# Altium project PCB.PrjPcb (part 8 of 8)

## Sheet USB.SchDoc
size 558 x 431 mm; SheetNumber: 16; SheetTotal: 25; Sheet_Name: USB; Size: 11x17
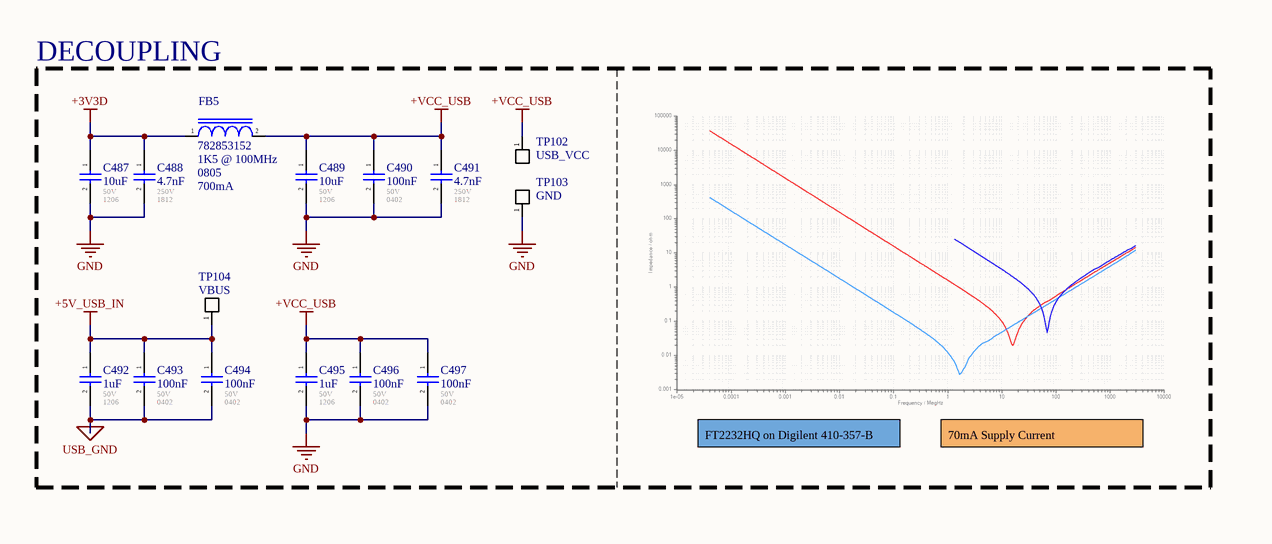
[diagram p51: USB.SchDoc, top left]
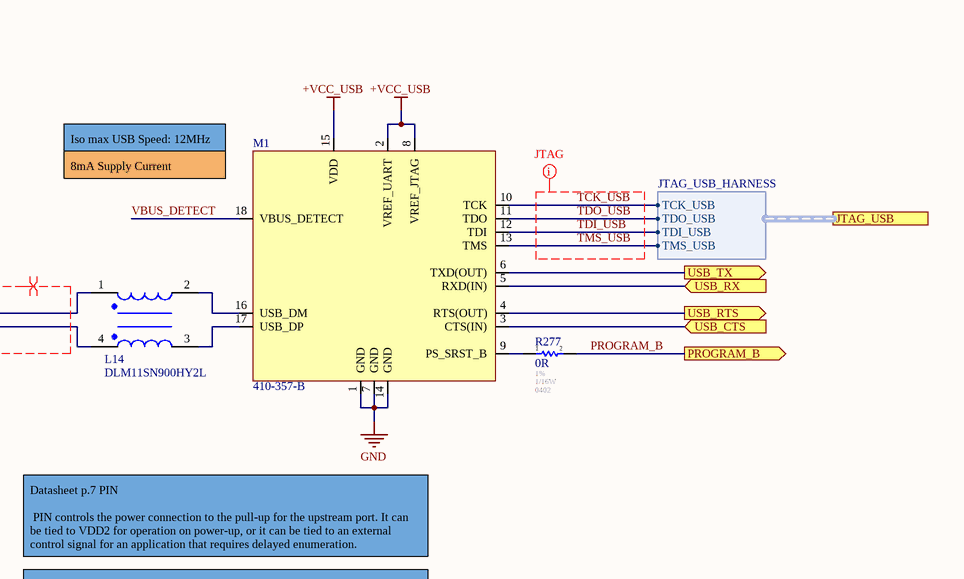
[diagram p52: USB.SchDoc, top right]
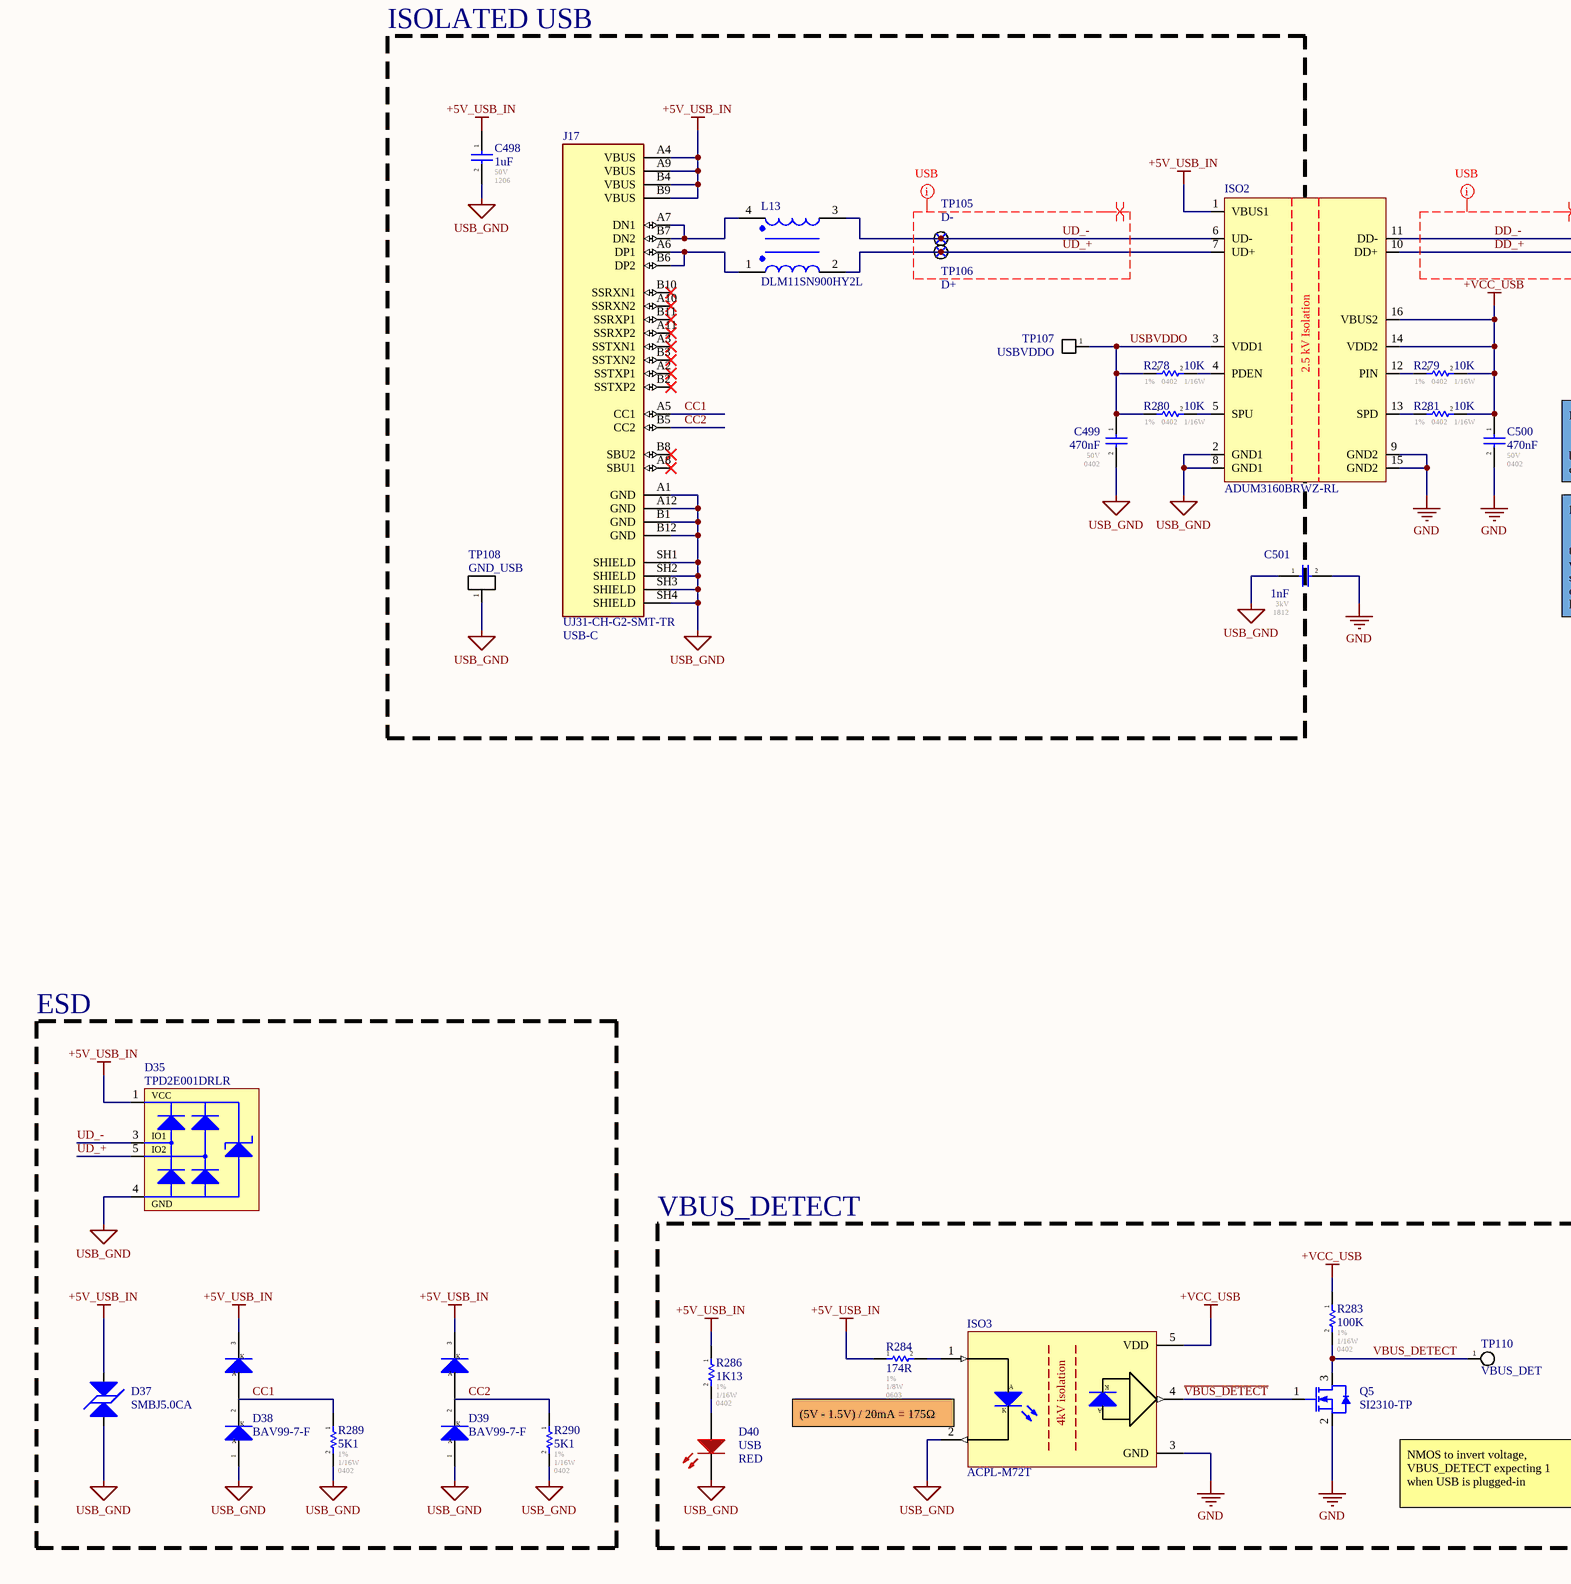
[diagram p53: USB.SchDoc, bottom left]
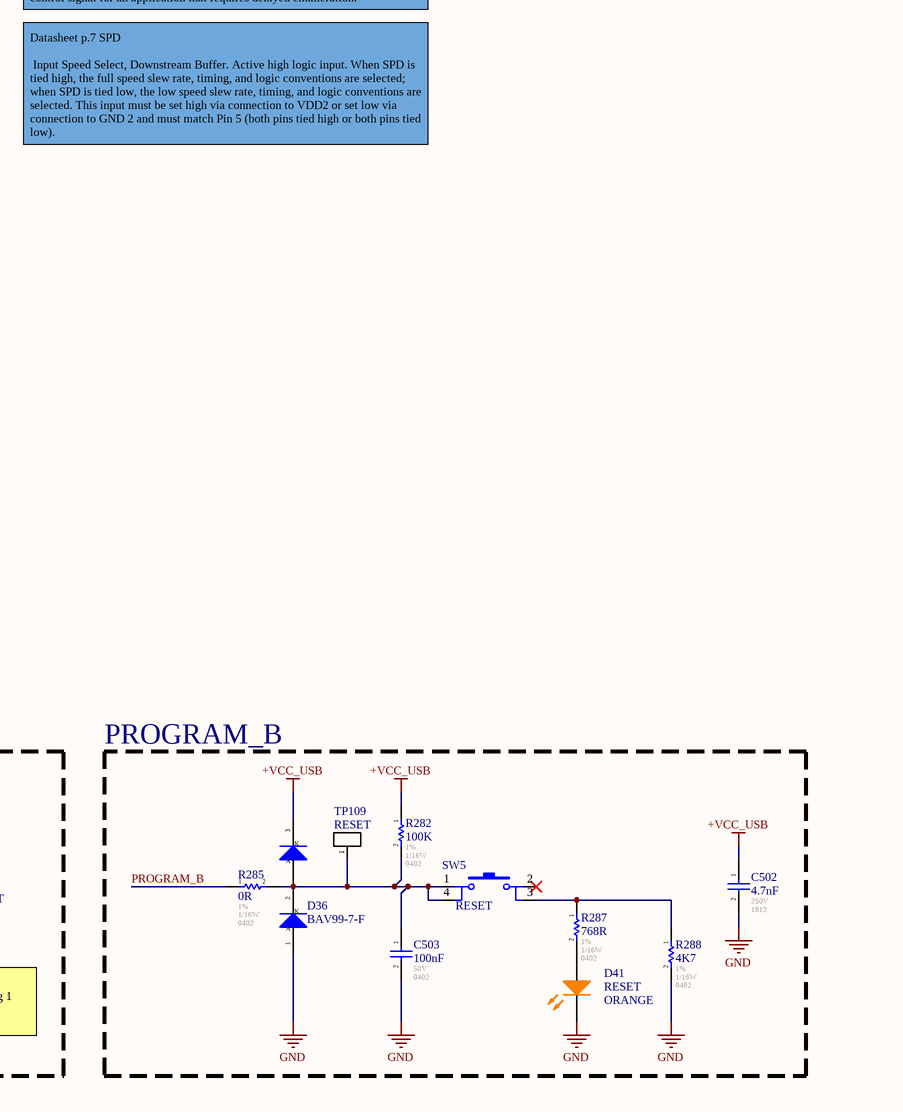
[diagram p54: USB.SchDoc, bottom right]

### Parts
C487  10uF  Voltage - Rated: 50V  Footprint: 1206  [CAP_1206]
C488  4.7nF  Voltage - Rated: 250V  Footprint: 1812  [CAP_1812]
C489  10uF  Voltage - Rated: 50V  Footprint: 1206  [CAP_1206]
C490  100nF  Voltage - Rated: 50V  Footprint: 0402  [CAP_0402]
C491  4.7nF  Voltage - Rated: 250V  Footprint: 1812  [CAP_1812]
C492  1uF  Voltage - Rated: 50V  Footprint: 1206  [CAP_1206]
C493  100nF  Voltage - Rated: 50V  Footprint: 0402  [CAP_0402]
C494  100nF  Voltage - Rated: 50V  Footprint: 0402  [CAP_0402]
C495  1uF  Voltage - Rated: 50V  Footprint: 1206  [CAP_1206]
C496  100nF  Voltage - Rated: 50V  Footprint: 0402  [CAP_0402]
C497  100nF  Voltage - Rated: 50V  Footprint: 0402  [CAP_0402]
C498  1uF  Voltage - Rated: 50V  Footprint: 1206  [CAP_1206]
C499  470nF  Voltage - Rated: 50V  Footprint: 0402  [CAP_0402]
C500  470nF  Voltage - Rated: 50V  Footprint: 0402  [CAP_0402]
C501  1nF  Voltage - Rated: 3kV  Footprint: 1812  [CAP_1812]
C502  4.7nF  Voltage - Rated: 250V  Footprint: 1812  [CAP_1812]
C503  100nF  Voltage - Rated: 50V  Footprint: 0402  [CAP_0402]
D35  TPD2E001DRLR  [TVS_USB_TPD2E001DRLR]
D36  BAV99-7-F  [SOT23-3]
D37  SMBJ5.0CA  [TVS_PWR_SMBJ5.0CA]
D38  BAV99-7-F  [SOT23-3]
D39  BAV99-7-F  [SOT23-3]
D40  USB  value RED  [LED_0603]
D41  RESET  value ORANGE  [LED_0603]
FB5  782853152  Impedance @ Freq: 1K5 @ 100MHz  Package / Case: 0805  Current Rating: 700mA  [IND_0805]
ISO2  ADUM3160BRWZ-RL  [ISO_ADUM3160BRWZ-RL]
ISO3  ACPL-M72T  [SOIC-5_4.4MM]
J17  UJ31-CH-G2-SMT-TR  Connector Type: USB-C  [UJ31-CH-G2-SMT-TR]
L13  DLM11SN900HY2L  [DLM11SN900HY2L]
L14  DLM11SN900HY2L  [DLM11SN900HY2L]
M1  410-357-B  [MOD_JTAG_410-357-B]
Q5  SI2310-TP  [TRX_NMOS_SI2310-TP]
R277  0R  Tolerance: 1%  Power: 1/16W  Package / Case: 0402  [RES_0402]
R278  10K  Tolerance: 1%  Power: 1/16W  Package / Case: 0402  [RES_0402]
R279  10K  Tolerance: 1%  Power: 1/16W  Package / Case: 0402  [RES_0402]
R280  10K  Tolerance: 1%  Power: 1/16W  Package / Case: 0402  [RES_0402]
R281  10K  Tolerance: 1%  Power: 1/16W  Package / Case: 0402  [RES_0402]
R282  100K  Tolerance: 1%  Power: 1/16W  Package / Case: 0402  [RES_0402]
R283  100K  Tolerance: 1%  Power: 1/16W  Package / Case: 0402  [RES_0402]
R284  174R  Tolerance: 1%  Power: 1/8W  Package / Case: 0603  [RES_0603]
R285  0R  Tolerance: 1%  Power: 1/16W  Package / Case: 0402  [RES_0402]
R286  1K13  Tolerance: 1%  Power: 1/16W  Package / Case: 0402  [RES_0402]
R287  768R  Tolerance: 1%  Power: 1/16W  Package / Case: 0402  [RES_0402]
R288  4K7  Tolerance: 1%  Power: 1/16W  Package / Case: 0402  [RES_0402]
R289  5K1  Tolerance: 1%  Power: 1/16W  Package / Case: 0402  [RES_0402]
R290  5K1  Tolerance: 1%  Power: 1/16W  Package / Case: 0402  [RES_0402]
SW5  RESET  [SWI_TACT_B3SN-3012P]
TP102  USB_VCC  [TP_PAD]  (no BOM)
TP103  GND  [TP_PAD]  (no BOM)
TP104  VBUS  [TP_PAD]  (no BOM)
TP105  D-  [TP_PAD_TINY]  (no BOM)
TP106  D+  [TP_PAD_TINY]  (no BOM)
TP107  USBVDDO  [TP_PAD]  (no BOM)
TP108  GND_USB  [TP_HOLE]  (no BOM)
TP109  RESET  [TP_HOLE]  (no BOM)
TP110  VBUS_DET  [TP_PAD_SMALL]  (no BOM)

### Blocks framed on the sheet
DECOUPLING: C487-C497 FB5 TP102-TP104
ISOLATED USB: C498 C499 J17 L13 R278 R280 TP105-TP108
ESD: D35 D37-D39 R289 R290
VBUS_DETECT: D40 ISO3 Q5 R283 R284 R286 TP110
PROGRAM_B: C502 C503 D36 D41 R282 R285 R287 R288 SW5 TP109

### Ports
JTAG_USB (harness JTAG_USB_HARNESS), PROGRAM_B (out), USB_CTS (in), USB_RTS (out), USB_RX (in), USB_TX (out)

### Harnesses
JTAG_USB_HARNESS: TCK_USB, TDO_USB, TDI_USB, TMS_USB

### Nets
+3V3D: C487.1 C488.1 FB5.1
+5V_USB_IN: C492.1 C493.1 C494.1 C498.1 D35.1(VCC) D37.1 D38.3(K) D39.3(K) ISO2.1(VBUS1) J17.A4(VBUS) J17.A9(VBUS) J17.B4(VBUS) J17.B9(VBUS) R284.1 R286.1 TP104.1(A)
+VCC_USB: C489.1 C490.1 C491.1 C495.1 C496.1 C497.1 C500.1 C502.1 D36.3(K) FB5.2 ISO2.14(VDD2) ISO2.16(VBUS2) ISO3.5(VDD) M1.2(VREF_UART) M1.8(VREF_JTAG) M1.15(VDD) R279.2 R281.2 R282.1 R283.1 TP102.1(A)
GND: C487.2 C488.2 C489.2 C490.2 C491.2 C495.2 C496.2 C497.2 C500.2 C501.2 C502.2 C503.2 D36.1(A) D41.2(K) ISO2.9(GND2) ISO2.15(GND2) ISO3.3(GND) M1.1(GND) M1.7(GND) M1.14(GND) Q5.2(S) R288.2 TP103.1(A)
USB_GND: C492.2 C493.2 C494.2 C498.2 C499.2 C501.1 D35.4(GND) D37.2 D38.1(A) D39.1(A) D40.2(K) ISO2.2(GND1) ISO2.8(GND1) ISO3.2(CATHODE) J17.A1(GND) J17.A12(GND) J17.B1(GND) J17.B12(GND) J17.SH1(SHIELD) J17.SH2(SHIELD) J17.SH3(SHIELD) J17.SH4(SHIELD) R289.2 R290.2 TP108.1(A)
~{VBUS_DETECT}: ISO3.4(VOUT) Q5.1(G)  [project net ~{VBUS_DETECT_16}]
CC1: D38.2(K) J17.A5(CC1) R289.1  [project net CC1_16]
CC2: D39.2(K) J17.B5(CC2) R290.1  [project net CC2_16]
DD_+: ISO2.10(DD+) L14.4  [project net DD_+_16]
DD_-: ISO2.11(DD-) L14.1  [project net DD_-_16]
PROGRAM_B: R277.2 R285.1 ; port PROGRAM_B
TCK_USB: M1.10(TCK) ; port JTAG_USB.TCK_USB
TDI_USB: M1.12(TDI) ; port JTAG_USB.TDI_USB
TDO_USB: M1.11(TDO) ; port JTAG_USB.TDO_USB
TMS_USB: M1.13(TMS) ; port JTAG_USB.TMS_USB
UD_+: D35.5(IO2) ISO2.7(UD+) L13.2 TP106.1(A)  [project net UD_+_16]
UD_-: D35.3(IO1) ISO2.6(UD-) L13.3 TP105.1(A)  [project net UD_-_16]
USB_CTS: M1.3(CTS(IN)) ; port USB_CTS
USB_RTS: M1.4(RTS(OUT)) ; port USB_RTS
USB_RX: M1.5(RXD(IN)) ; port USB_RX
USB_TX: M1.6(TXD(OUT)) ; port USB_TX
USBVDDO: C499.1 ISO2.3(VDD1) R278.1 R280.1 TP107.1(A)  [project net USBVDDO_16]
VBUS_DETECT: M1.18(VBUS_DETECT) Q5.3(D) R283.2 TP110.1(A)  [project net VBUS_DETECT_16]
NetC503_1: C503.1 D36.2(K) R282.2 R285.2 SW5.1 SW5.4 TP109.1(A)
NetD40_1: D40.1(A) R286.2
NetD41_1: D41.1(A) R287.2
NetISO2_4: ISO2.4(PDEN) R278.2
NetISO2_5: ISO2.5(SPU) R280.2
NetISO2_12: ISO2.12(PIN) R279.1
NetISO2_13: ISO2.13(SPD) R281.1
NetISO3_1: ISO3.1(ANODE) R284.2
NetJ17_A6: J17.A6(DP1) J17.B6(DP2) L13.1
NetJ17_A7: J17.A7(DN1) J17.B7(DN2) L13.4
NetL14_2: L14.2 M1.16(USB_DM)
NetL14_3: L14.3 M1.17(USB_DP)
NetM1_9: M1.9(PS_SRST_B) R277.1
NetR287_1: R287.1 R288.1 SW5.3

Not connected (* = marked no-connect by the designer): D35 2(NC); J17 A2(SSTXP1)* A3(SSTXN1)* A8(SBU1)* A10(SSRXN2)* A11(SSRXP2)* B2(SSTXP2)* B3(SSTXN2)* B8(SBU2)* B10(SSRXN1)* B11(SSRXP1)*; SW5 2*

### Layout directives
net class USB: DD_+, DD_-, UD_+, UD_-
differential pair: DD_+, DD_-, UD_+, UD_-
net class JTAG: TCK_USB, TDI_USB, TDO_USB, TMS_USB

### Notes on the sheet
- FT2232HQ on Digilent 410-357-B
- 70mA Supply Current
- (near M1) Iso max USB Speed: 12MHz
- (near M1) 8mA Supply Current
- Datasheet p.7 PIN
  PIN controls the power connection to the pull-up for the upstream port. It can be tied to VDD2 for operation on power-up, or it can be tied to an external control signal for an application that requires delayed enumeration.
- Datasheet p.7 SPD
  Input Speed Select, Downstream Buffer. Active high logic input. When SPD is tied high, the full speed slew rate, timing, and logic conventions are selected; when SPD is tied low, the low speed slew rate, timing, and logic conventions are selected. This input must be set high via connection to VDD2 or set low via connection to GND 2 and must match Pin 5 (both pins tied high or both pins tied low).
- (near ISO3) (5V - 1.5V) / 20mA = 175Ω
- NMOS to invert voltage, VBUS_DETECT expecting 1 when USB is plugged-in
- Sheet Name
- Project Title
- Global Project
- Revision
- Size
- Date
- Group
- Sheet
- of
- Filename
- Designers
- (in symbol ACPL-M72T) A; K; 4kV isolation
- (in symbol ISO_ADUM3160BRWZ-RL) 2.5 kV Isolation

### Library data of the parts
C487 C489 = CAP_CER: GRT31CR61H106KE01L / 1206 10uF 10% X5R Ceramic Capacitor; Mfr: Murata; Operating Temperature: -55C - 85C; Temperature Coefficient: X5R; ComponentLink1Description: Digikey; ComponentLink2Description: Datasheet; Tolerance: 10%; Ratings: AEC-Q200; Part#: GRT31CR61H106KE01L
  C487: ComponentLink1URL: https://www.digikey.ca/en/products/detail/murata-electronics/GRT31CR61H106KE01L/5416878; ComponentLink2URL: https://search.murata.co.jp/Ceramy/image/img/A01X/G101/ENG/GRT31CR61H106KE01-01.pdf; ComponentLink3Description: Octopart; ComponentLink3URL: https://octopart.com/grt31cr61h106ke01l-murata-62921736; ComponentLink4Description: Murata; ComponentLink4URL: https://www.murata.com/en-us/products/productdetail?partno=GRT31CR61H106KE01%23
  C489: ComponentLink1URL: [Digikey Link]; ComponentLink2URL: [Datasheet Link]
C488 C491 C502 = CAP_CER: GA343DR7GD472KW01L / 0402 4.7nF 10% X7R 1812 250VAC Ceramic Capacitor; Mfr: Murata; Ratings: Y3 - Safety; Operating Temperature: -55C - 125C; Temperature Coefficient: X7R; ComponentLink1Description: Digikey; ComponentLink1URL: https://www.digikey.ca/en/products/detail/murata-electronics/GA343DR7GD472KW01L/789292; ComponentLink2Description: Datasheet; ComponentLink2URL: https://search.murata.co.jp/Ceramy/image/img/A01X/G101/ENG/GA343DR7GD472KW01-01.pdf; ComponentLink3Description: Octopart; ComponentLink3URL: https://octopart.com/ga343dr7gd472kw01l-murata-197048?r=sp; Tolerance: 10%; Part#: GA343DR7GD472KW01L
  C502: ComponentLink4Description: Murata; ComponentLink4URL: https://www.murata.com/en-us/products/productdetail?partno=GA343DR7GD472KW01%23
C490 C493 C494 C496 C497 C503 = CAP_CER: GCM155R71H104KE02J / 0402 100nF 10% X7R Ceramic Capacitor; Mfr: Murata; Operating Temperature: -55C - 125C; Temperature Coefficient: X7R; ComponentLink1Description: Digikey; ComponentLink1URL: [Digikey Link]; Part#: GCM155R71H104KE02J; ComponentLink2Description: Datasheet; ComponentLink2URL: [Datasheet Link]; Tolerance: 10%; Ratings: AEC-Q200
C492 C495 C498 = CAP_CER: GCJ31CR71H105KA12L / 1206 1uF 10% X7R Ceramic Capacitor; Mfr: Murata; Operating Temperature: -55C - 125C; Temperature Coefficient: X7R; ComponentLink1Description: Digikey; Part#: GCJ31CR71H105KA12L; ComponentLink2Description: Datasheet; Tolerance: 10%; Ratings: AEC-Q200
  C492: ComponentLink1URL: https://www.digikey.ca/en/products/detail/murata-electronics/GCJ31CR71H105KA12L/10690321; ComponentLink2URL: https://search.murata.co.jp/Ceramy/image/img/A01X/G101/ENG/GCJ31CR71H105KA12-02B.pdf; ComponentLink3Description: Octopart; ComponentLink3URL: https://octopart.com/gcj31cr71h105ka12l-murata-57352446?r=sp; ComponentLink4Description: Murata; ComponentLink4URL: https://www.murata.com/en-us/products/productdetail?partno=GCJ31CR71H105KA12%23
  C495 C498: ComponentLink1URL: [Digikey Link]; ComponentLink2URL: [Datasheet Link]
C499 C500 = CAP_CER: CGA3E3X7R1H474K080AB / 0603 470nF 10% X7R Ceramic Capacitor; Mfr: TDK; Operating Temperature: -55C - 125C; Temperature Coefficient: X7R; ComponentLink1Description: Digikey; Part#: CGA3E3X7R1H474K080AB; ComponentLink2Description: Datasheet; Tolerance: 10%; Ratings: AEC-Q200
  C499: ComponentLink1URL: https://www.digikey.ca/en/products/detail/murata-electronics/GCM21BR71H474KA55L/1641662; ComponentLink2URL: https://search.murata.co.jp/Ceramy/image/img/A01X/G101/ENG/GCM21BR71H474KA55-01A.pdf; ComponentLink3Description: Octopart; ComponentLink3URL: https://octopart.com/gcm21br71h474ka55l-murata-7894857; ComponentLink4Description: Murata; ComponentLink4URL: https://www.murata.com/en-us/products/productdetail?partno=GCM21BR71H474KA55%23
  C500: ComponentLink1URL: [Digikey Link]; ComponentLink2URL: [Datasheet Link]
C501 = CAP_CER: C1812C102KHRACAUTO / 0402 470pF 10% X7R Ceramic Capacitor; Mfr: KEMET; Operating Temperature: -55C - 125C; Temperature Coefficient: X7R; ComponentLink1Description: Digikey; ComponentLink1URL: https://www.digikey.com/en/products/detail/kemet/C1812C102KHRACAUTO/8109956; Part#: C1812C102KHRACAUTO; ComponentLink2Description: Datasheet; ComponentLink2URL: https://connect.kemet.com:7667/gateway/IntelliData-ComponentDocumentation/1.0/download/datasheet/C1812C102KHRACAUTO; Tolerance: 10%; Ratings: AEC-Q200; ComponentLink3Description: KEMET; ComponentLink3URL: https://www.kemet.com/en/us/capacitors/ceramic/product/C1812C102KHRACAUTO.html; ComponentLink4Description: Octopart; ComponentLink4URL: https://octopart.com/c1812c102khracauto-kemet-67309371?r=sp; Features: Low ESL, High Voltage; Supplier 1: Mouser; Supplier Part Number 1: 80-C1812C102KHRAUTO
D35 = TVS_USB_TPD2E001DRLR: TVS - USB TVS DIODE 5.5V - SOT-553; Manufacturer #1: Texas Instruments; Value: 11V Breakdown; Voltage Rating: 5.5V (Max); GRAMS Lib Spec: 2.8; Magnetic Material: YES; Cryo: UNKNOWN; Tolerance: *; Current Rating: *; Power Max: *; HelpURL: http://www.ti.com/lit/ds/symlink/tpd2e001.pdf; CreatedBy/Date: Jonathan Bouchard 2018-07-10; VerifiedBy: Arnaud Samson 16-07-18; Temperature: -40°C ~ 85°C (TA); Package: SOT-553; Manufacturer #2: *; Note: *; Assembly Type: SMD; Part Number #2: *; Part Number #1: TPD2E001DRLR; Polarized: YES; Supplier 1: Digi-Key; Supplier Part Number 1: 296-21883-1-ND
D36 D38 D39 = DIODE_TVS_DUAL: Diode Array 1 Pair Series Connection 75 V 300mA (DC) Surface Mount TO-236-3, SC-59, SOT-23-3; Mfr: Diodes Incorporated; Voltage - DC Reverse: 75V; Voltage - Forward: 1.25V @ 150mA; Reverse Recovery Time: 4ns; Capacitance: 2pF; Current - Reverse Leakage: 2.5µA @ 75V; Operating Temperature: -65C - 150C; Package / Case: SOT-23-3; Current: 300mA; ComponentLink1Description: Digikey; ComponentLink1URL: https://www.digikey.ca/en/products/detail/diodes-incorporated/BAV99-7-F/815018; ComponentLink2Description: Datasheet; ComponentLink2URL: https://www.diodes.com/assets/Datasheets/BAV99.pdf; ComponentLink3Description: Octopart; ComponentLink3URL: https://octopart.com/bav99-7-f-diodes+inc.-326328; Supplier 1: Future Electronics; Supplier Part Number 1: 3851920
D37 = TVS_PWR_SMBJ5.0CA: TVS - BIDIR 5V 9.2V 600W - DO214AA; Manufacturer #1: Littelfuse Inc.; Value: Vbr = 6.4V -  Clamp = 9.2V; Voltage Rating: 5V Standoff; Current Rating: 65.3 A (Ipp); Power Max: 600W (Pppm); GRAMS Lib Spec: 2.8; Magnetic Material: UNKNOWN; Polarized: NO; Tolerance: *; HelpURL: http://www.littelfuse.com/~/media/electronics/datasheets/tvs_diodes/littelfuse_tvs_diode_smbj_datasheet.pdf.pdf; CreatedBy/Date: Jonathan Bouchard - 2019-03-22; VerifiedBy: Nicolas V. (2019-05-06); Temperature: -65°C ~ 150°C (TJ); Package: DO214AA; Manufacturer #2: *; Note: *; Assembly Type: SMD; Part Number #2: *; Part Number #1: SMBJ5.0CA; Supplier 1: Digi-Key; Supplier Part Number 1: SMBJ5.0CALFCT-ND; Cryo: UNKNOWN
D40 = LED_SML-311UTT86: LED - 620nM RED 2mA - 0603; Voltage: 1.8V; Mfg: ROHM Semiconductor; Power: 44mW; Current: 2mA; HelpURL: http://media.digikey.com/pdf/Data%20Sheets/Rohm%20PDFs/SML-311%20Series.pdf; CreatedBy: Jonathan Bouchard; Temperature: -30°C to 85°C; Package: 0603; Precision: *; Mfg Part Number: SML-311UTT86; Supplier 1: Digikey; Supplier Part Number 1: 511-1304-1-ND
D41 = LED_SML-311DTT86: LED - 611nM ORANGE 2mA - 0603; Voltage: 1.8V; Mfg: ROHM Semiconductor; Power: 44mW; Current: 2mA; HelpURL: http://media.digikey.com/pdf/Data%20Sheets/Rohm%20PDFs/SML-311%20Series.pdf; CreatedBy: Jonathan Bouchard; Temperature: -40°C to 85°C; Package: 0603; Precision: *; Mfg Part Number: SML-311DTT86; Supplier 1: Digikey; Supplier Part Number 1: 511-1303-1-ND
FB5 = FERRITE_BEAD: 600 Ohms @ 100 MHz 1 Signal Line Ferrite Bead 0603 (1608 Metric) 1A 200mOhm; Manufacturer: Wurth Elektronik; Resistance: 350mR; Operating Temperature: -55C - 125C; Rating: AEC-Q200; ComponentLink1Description: Digikey; ComponentLink1URL: https://www.digikey.ca/en/products/detail/w%C3%BCrth-elektronik/782853152/5168812; ComponentLink3Description: Octopart; ComponentLink3URL: https://octopart.com/782853152-wurth+elektronik-56466774?r=sp; ComponentLink5Description: Datasheet; ComponentLink5URL: https://www.we-online.com/en/components/products/datasheet/782853152.pdf
ISO2 = ISO_ADUM3160BRWZ-RL: ISO - DGTL ISO 2.5KV 2CH USB - 16SOIC; Manufacturer #1: Analog Devices; Value: 2500Vrms voltage isolation; Voltage Rating: 3~5.5V; GRAMS Lib Spec: 2.8; Magnetic Material: UNKNOWN; Polarized: Yes; Tolerance: *; Current Rating: *; Power Max: *; HelpURL: https://www.analog.com/media/en/technical-documentation/data-sheets/ADuM3160.pdf; CreatedBy/Date: Tommy Rossignol 2018-11-16; VerifiedBy: Caroline Paulin - 13 février 2019; Temperature: -40°C ~ 105°C; Package: 16-SOIC; Manufacturer #2: *; Assembly Type: SMD; Part Number #2: *; Part Number #1: ADUM3160BRWZ-RL; Supplier 1: Digi-Key; Supplier Part Number 1: ADUM3160BRWZ-RLCT-ND; Cryo: UNKNOWN
ISO3 = ACPL-M72T: Logic Output Optoisolator Push-Pull, Totem Pole 4000Vrms 1 Channel 25kV/µs CMTI 5-SO; Mfr: Broadcom Limited; Number of channels: 1; Common Mode Transient: 25kV/us; Voltage - Forward: 1.5V; Current - Forward: 20mA; Voltage - Supply: 3V - 5.5V; Qualification: AEC-Q100; Voltage - Isolation: 4000Vrms; Output Topology: Push-Pull; Operating Temperature: -40C - 125C; Package: SOIC6 - 5 Leads; ComponentLink1Description: Digikey; ComponentLink1URL: https://www.digikey.ca/en/products/detail/broadcom-limited/ACPL-M72T-000E/2347227; ComponentLink2Description: Datasheet; ComponentLink2URL: https://docs.broadcom.com/doc/AV02-2180EN
J17 = CONN_UJ31-CH-G2-SMT-TR: Type C, USB 3.1 Gen 2, 5 A, Right Angle, Surface Mount _SMT_, USB Receptacle; Mfr: CUI Devices; Number of Contacts: 24; Specifications: USB 3.2 Gen 2 (USB 3.1 Gen 2, Superspeed + (USB 3.1)); Current Rating: 6.25A; Voltage Rating: 20V; Operating Temperature: -25C - 80C; Digikey Part Number: 102-4483-1-ND; ComponentLink1Description: Digikey; ComponentLink1URL: https://www.digikey.ca/en/products/detail/cui-devices/UJ31-CH-G2-SMT-TR/8024057; Supplier 1: Digi-Key; Supplier Part Number 1: 102-4483-1-ND
L13 L14 = IND_DLM11SN900HY2L: 2 Line Common Mode Choke Surface Mount 90 Ohms @ 100MHz 100mA DCR 1.38Ohm; Voltage Rating: 5V; Impedance: 90 Ohms @ 100MHz; Current Rating: 100mA; DC resistance: 1.38Ohm; Operating Temperature: -40C - 85C; Package: 0504; Supplier 1: Digi-Key; Supplier Part Number 1: 490-11941-1-ND
M1 = MOD_JTAG_410-357-B: MOD - JTAG-SMT3-NC Programming Module For Xilinx FPGA - 18-SMT; Manufacturer #1: Digilent; Voltage Rating: VDD: 2.97V~3.63V, VJTAG/VUART: 1.65V~5.5V; GRAMS Lib Spec: 2.8; Note: Prior to reflow, the JTAG-SMT3-NC module must be dried at 125°C for 17 hours; Magnetic Material: Unknown; Polarized: Yes; Value: *; Tolerance: *; Current Rating: *; Power Max: *; HelpURL: https://reference.digilentinc.com/_media/reference/programmers/jtag-smt3/jtag-smt3-nc_rm.pdf; CreatedBy/Date: Tommy Rossignol 2018-11-23; VerifiedBy: Nicolas V. (2019-01-28); Temperature: -40°C ~ 85°C; Package: 18-pad SMT; Manufacturer #2: *; Assembly Type: SMD; Part Number #2: *; Part Number #1: 410-357-B; Supplier 1: Digi-Key; Supplier Part Number 1: 1286-1196-ND; Cryo: UNKNOWN
Q5 = TRX_NMOS_SI2310-TP: TRX - MOSFET N-CH 60V 3A - SOT-23; Manufacturer #1: Micro Commercial Co; Power Max: 350mW; Voltage rating: 60V (Vds max), 2V (Vgs @ 250uA); Polarized: Yes; Magnetic Material: UNKNOWN; GRAMS Lib Spec: 2.8c; Current Rating: 3A; Manufacturer #2: *; Value: *; Part Number #1: SI2310-TP; Part Number #2: *; HelpURL: https://www.mccsemi.com/pdf/Products/SI2310(SOT-23)-A.pdf; Supplier 1: Digi-Key; Supplier Part Number 1: SI2310-TPMSCT-ND; Assembly Type: SMD; Temperature: -55°C ~ 150°C (TJ); Package: SOT-23; CreatedBy/Date: Louis-Daniel Gaulin / 20-02-2020; Tolerance: *; VerifiedBy: C.Paulin - 21/02/2020; Cryo: UNKNOWN
R277-R290 = RESISTOR: Automotive: AEC-Q200; Operating Temperature: *; # Digikey: *; ComponentLink1Description: Digikey; ComponentLink1URL: *; # Manufacturer: *
SW5 = SWI_TACT_B3SN-3012P: SWI - TACT SPST-NO 0.05A 24V - 4-SMD; Current: 50mA; Mfg: Omron; Mfg Part Number: B3SN-3012P; HelpURL: http://www.omron.com/ecb/products/pdf/en-b3sn.pdf; CreatedBy: Jonathan Bouchard; Temperature: -25°C ~ 70°C; Power: *; Precision: *; Package: 4-SMD; Value: *; Voltage: 24V; Supplier 1: Digikey; Supplier Part Number 1: SW261CT-ND
TP102-TP104 TP107 = TESTPOINT_PAD: Test Point
TP105 TP106 = TESTPOINT_PAD_TINY: Test Point
TP108 TP109 = TESTPOINT: Test Point; ClassName: Testpoint
TP110 = TESTPOINT_PAD_SMALL: Test Point

## Sheet ETHERNET.SchDoc
size 558 x 431 mm; SheetNumber: 17; SheetTotal: 25; Sheet_Name: Ethernet; Size: 11x17
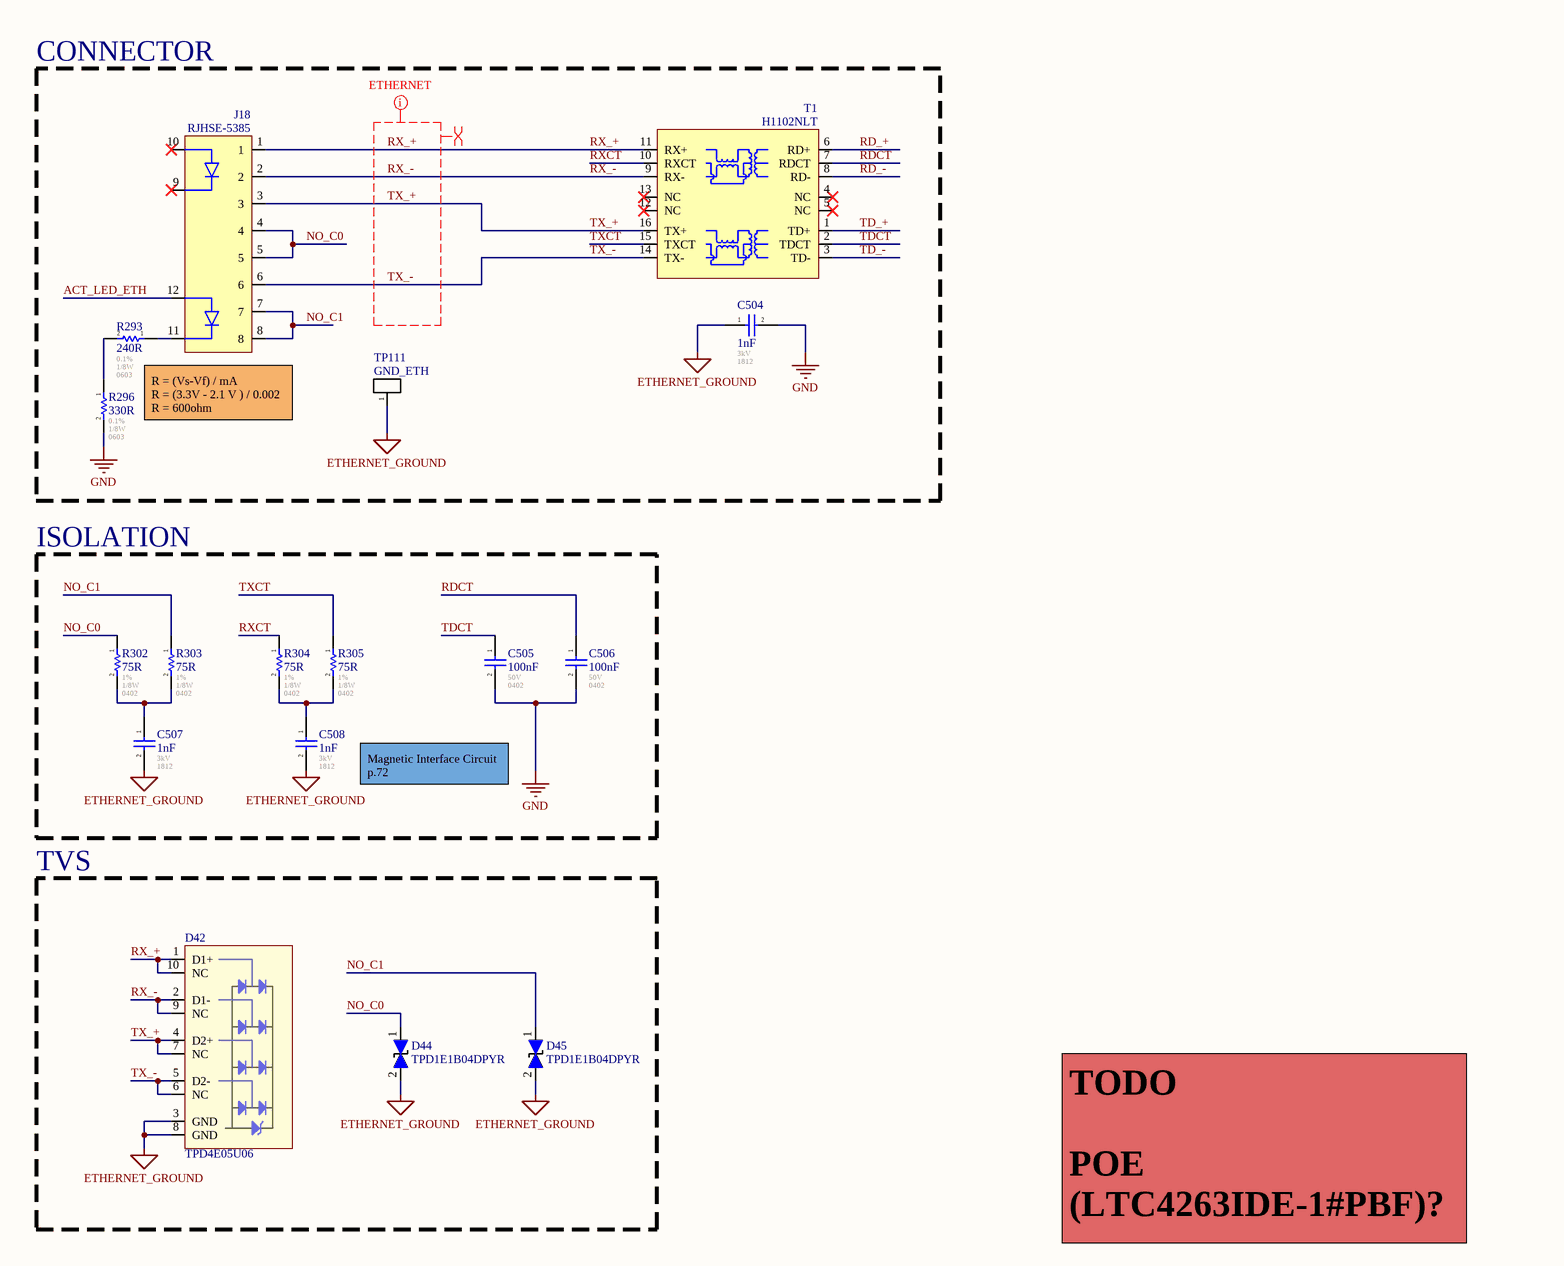
[diagram p55: ETHERNET.SchDoc, top left]
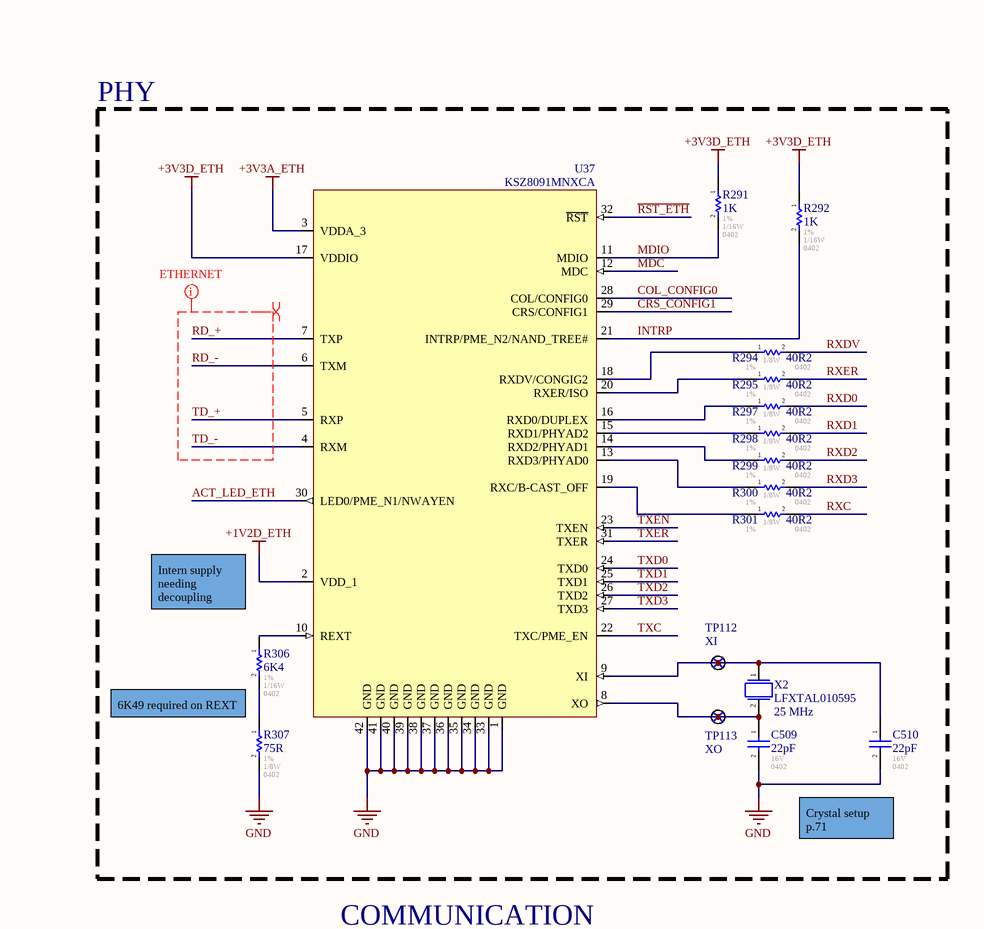
[diagram p56: ETHERNET.SchDoc, top right]
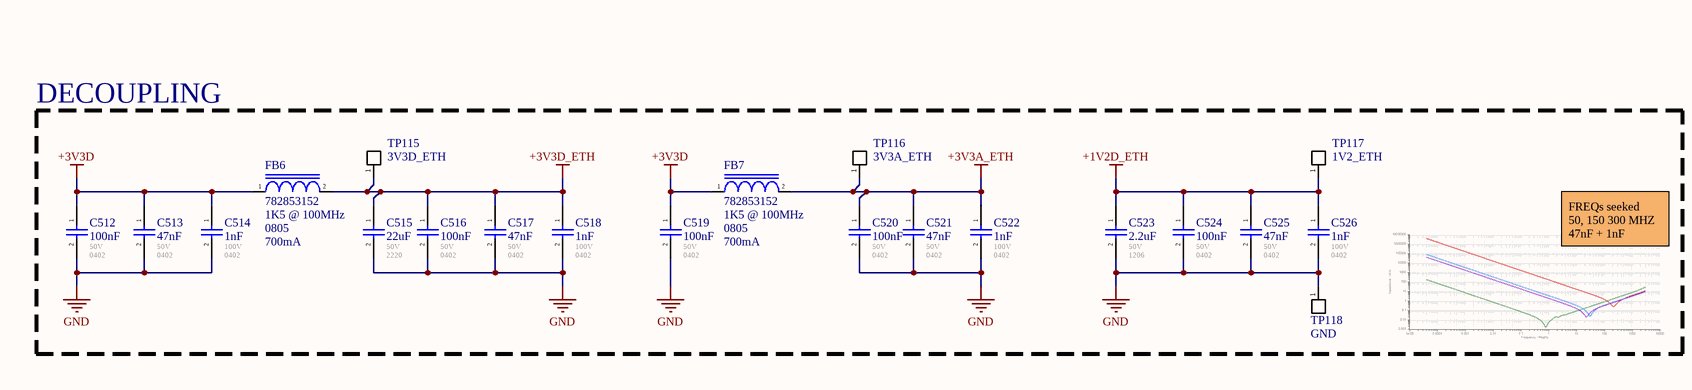
[diagram p57: ETHERNET.SchDoc, bottom left]
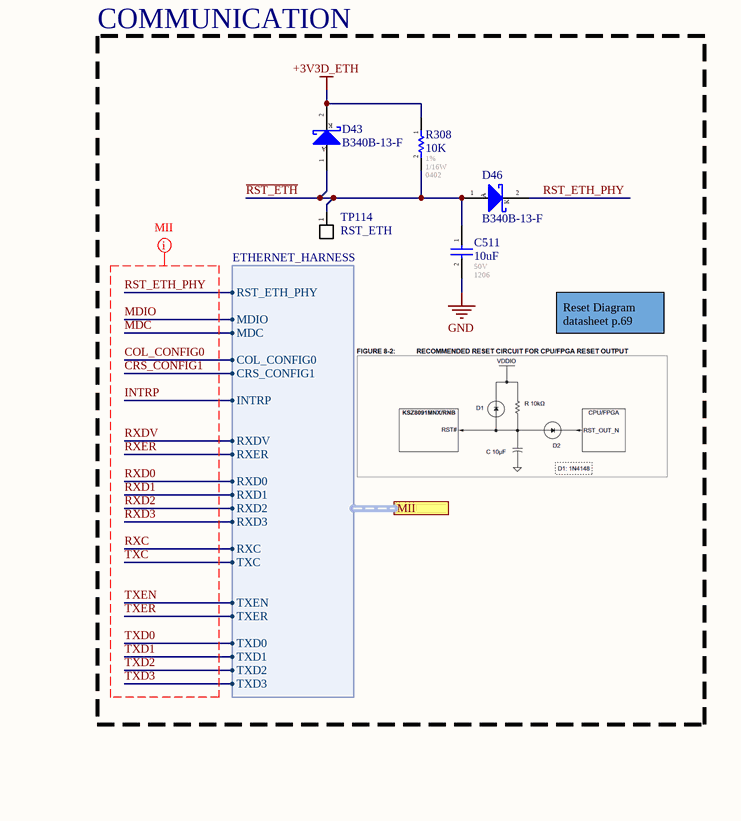
[diagram p58: ETHERNET.SchDoc, bottom right]

### Parts
C504  1nF  Voltage - Rated: 3kV  Footprint: 1812  [CAP_1812]
C505  100nF  Voltage - Rated: 50V  Footprint: 0402  [CAP_0402]
C506  100nF  Voltage - Rated: 50V  Footprint: 0402  [CAP_0402]
C507  1nF  Voltage - Rated: 3kV  Footprint: 1812  [CAP_1812]
C508  1nF  Voltage - Rated: 3kV  Footprint: 1812  [CAP_1812]
C509  22pF  Voltage - Rated: 16V  Footprint: 0402  [CAP_0402]
C510  22pF  Voltage - Rated: 16V  Footprint: 0402  [CAP_0402]
C511  10uF  Voltage - Rated: 50V  Footprint: 1206  [CAP_1206]
C512  100nF  Voltage - Rated: 50V  Footprint: 0402  [CAP_0402]
C513  47nF  Voltage - Rated: 50V  Footprint: 0402  [CAP_0402]
C514  1nF  Voltage - Rated: 100V  Footprint: 0402  [CAP_0402]
C515  22uF  Voltage - Rated: 50V  Footprint: 2220  [CAP_2220]
C516  100nF  Voltage - Rated: 50V  Footprint: 0402  [CAP_0402]
C517  47nF  Voltage - Rated: 50V  Footprint: 0402  [CAP_0402]
C518  1nF  Voltage - Rated: 100V  Footprint: 0402  [CAP_0402]
C519  100nF  Voltage - Rated: 50V  Footprint: 0402  [CAP_0402]
C520  100nF  Voltage - Rated: 50V  Footprint: 0402  [CAP_0402]
C521  47nF  Voltage - Rated: 50V  Footprint: 0402  [CAP_0402]
C522  1nF  Voltage - Rated: 100V  Footprint: 0402  [CAP_0402]
C523  2.2uF  Voltage - Rated: 50V  Footprint: 1206  [CAP_1206]
C524  100nF  Voltage - Rated: 50V  Footprint: 0402  [CAP_0402]
C525  47nF  Voltage - Rated: 50V  Footprint: 0402  [CAP_0402]
C526  1nF  Voltage - Rated: 100V  Footprint: 0402  [CAP_0402]
D42  TPD4E05U06  [TVS_DATA_TPD4E05U06]
D43  B340B-13-F  [DO214AA (SMB)]
D44  TPD1E1B04DPYR  [TVS_DATA_TPD1E1B04DPYR]
D45  TPD1E1B04DPYR  [TVS_DATA_TPD1E1B04DPYR]
D46  B340B-13-F  [DO214AA (SMB)]
FB6  782853152  Impedance @ Freq: 1K5 @ 100MHz  Package / Case: 0805  Current Rating: 700mA  [IND_0805]
FB7  782853152  Impedance @ Freq: 1K5 @ 100MHz  Package / Case: 0805  Current Rating: 700mA  [IND_0805]
J18  RJHSE-5385  [CONN_ETHERNET_RJHSE-5385]
R291  1K  Tolerance: 1%  Power: 1/16W  Package / Case: 0402  [RES_0402]
R292  1K  Tolerance: 1%  Power: 1/16W  Package / Case: 0402  [RES_0402]
R293  240R  Tolerance: 0.1%  Power: 1/8W  Package / Case: 0603  [RES_0603]
R294  40R2  Tolerance: 1%  Power: 1/8W  Package / Case: 0402  [RES_0402]
R295  40R2  Tolerance: 1%  Power: 1/8W  Package / Case: 0402  [RES_0402]
R296  330R  Tolerance: 0.1%  Power: 1/8W  Package / Case: 0603  [RES_0603]
R297  40R2  Tolerance: 1%  Power: 1/8W  Package / Case: 0402  [RES_0402]
R298  40R2  Tolerance: 1%  Power: 1/8W  Package / Case: 0402  [RES_0402]
R299  40R2  Tolerance: 1%  Power: 1/8W  Package / Case: 0402  [RES_0402]
R300  40R2  Tolerance: 1%  Power: 1/8W  Package / Case: 0402  [RES_0402]
R301  40R2  Tolerance: 1%  Power: 1/8W  Package / Case: 0402  [RES_0402]
R302  75R  Tolerance: 1%  Power: 1/8W  Package / Case: 0402  [RES_0402]
R303  75R  Tolerance: 1%  Power: 1/8W  Package / Case: 0402  [RES_0402]
R304  75R  Tolerance: 1%  Power: 1/8W  Package / Case: 0402  [RES_0402]
R305  75R  Tolerance: 1%  Power: 1/8W  Package / Case: 0402  [RES_0402]
R306  6K4  Tolerance: 1%  Power: 1/16W  Package / Case: 0402  [RES_0402]
R307  75R  Tolerance: 1%  Power: 1/8W  Package / Case: 0402  [RES_0402]
R308  10K  Tolerance: 1%  Power: 1/16W  Package / Case: 0402  [RES_0402]
T1  H1102NLT  [TRANSFO_H1102NLT]
TP111  GND_ETH  [TP_HOLE]  (no BOM)
TP112  XI  [TP_PAD_TINY]  (no BOM)
TP113  XO  [TP_PAD_TINY]  (no BOM)
TP114  RST_ETH  [TP_PAD]  (no BOM)
TP115  3V3D_ETH  [TP_PAD]  (no BOM)
TP116  3V3A_ETH  [TP_PAD]  (no BOM)
TP117  1V2_ETH  [TP_PAD]  (no BOM)
TP118  GND  [TP_PAD]  (no BOM)
U37  KSZ8091MNXCA  [COM_ETH_PHY_KSZ8091MNXCA]
X2  LFXTAL010595  Frequency: 25 MHz  [HC49_SMD]

### Blocks framed on the sheet
CONNECTOR: C504 J18 R293 R296 T1 TP111
PHY: C509 C510 R291 R292 R294 R295 R297-R301 R306 R307 TP112 TP113 U37 X2
ISOLATION: C505-C508 R302-R305
TVS: D42 D44 D45
COMMUNICATION: C511 D43 D46 R308 TP114
DECOUPLING: C512-C526 FB6 FB7 TP115-TP118

### Ports
MII (harness ETHERNET_HARNESS)

### Harnesses
ETHERNET_HARNESS: MDIO, MDC, COL_CONFIG0, CRS_CONFIG1, INTRP, RXDV, RXER, RXD0, RXD1, RXD2, RXD3, RXC, TXEN, TXER, TXD0, TXD1, TXD2, TXD3, TXC, RST_ETH_PHY

### Nets
+1V2D_ETH: C523.1 C524.1 C525.1 C526.1 TP117.1(A) U37.2(VDD_1)
+3V3A_ETH: C520.1 C521.1 C522.1 FB7.2 TP116.1(A) U37.3(VDDA_3)
+3V3D: C512.1 C513.1 C514.1 C519.1 FB6.1 FB7.1
+3V3D_ETH: C515.1 C516.1 C517.1 C518.1 D43.2(K) FB6.2 R291.1 R292.1 R308.1 TP115.1(A) U37.17(VDDIO)
ETHERNET_GROUND: C504.1 C507.2 C508.2 D42.3(GND) D42.8(GND) D44.2(i/o) D45.2(i/o) TP111.1(A)
GND: C504.2 C505.2 C506.2 C509.2 C510.2 C511.2 C512.2 C513.2 C514.2 C515.2 C516.2 C517.2 C518.2 C519.2 C520.2 C521.2 C522.2 C523.2 C524.2 C525.2 C526.2 R296.2 R307.2 TP118.1(A) U37.1(GND) U37.33(GND) U37.34(GND) U37.35(GND) U37.36(GND) U37.37(GND) U37.38(GND) U37.39(GND) U37.40(GND) U37.41(GND) U37.42(GND)
~{RST_ETH}: C511.1 D43.1(A) D46.1(A) R308.2 TP114.1(A) U37.32(~{RST})  [project net ~{RST_ETH_17}]
ACT_LED_ETH: J18.12(LED2_A) U37.30(LED0/PME_N1/NWAYEN)  [project net ACT_LED_ETH_17]
COL_CONFIG0: U37.28(COL/CONFIG0) ; port MII.COL_CONFIG0
CRS_CONFIG1: U37.29(CRS/CONFIG1) ; port MII.CRS_CONFIG1
INTRP: R292.2 U37.21(INTRP/PME_N2/NAND_TREE#) ; port MII.INTRP
MDC: U37.12(MDC) ; port MII.MDC
MDIO: R291.2 U37.11(MDIO) ; port MII.MDIO
NO_C0: D44.1(i/o) J18.4 J18.5 R302.1  [project net NO_C0_17]
NO_C1: D45.1(i/o) J18.7 J18.8 R303.1  [project net NO_C1_17]
RD_+: T1.6(RD+) U37.7(TXP)  [project net RD_+_17]
RD_-: T1.8(RD-) U37.6(TXM)  [project net RD_-_17]
RDCT: C506.1 T1.7(RDCT)  [project net RDCT_17]
RST_ETH_PHY: D46.2(K) ; port MII.RST_ETH_PHY
RX_+: D42.1(D1+) D42.10(NC) J18.1 T1.11(RX+)  [project net RX_+_17]
RX_-: D42.2(D1-) D42.9(NC) J18.2 T1.9(RX-)  [project net RX_-_17]
RXC: R301.2 ; port MII.RXC
RXCT: R304.1 T1.10(RXCT)  [project net RXCT_17]
RXD0: R297.2 ; port MII.RXD0
RXD1: R298.2 ; port MII.RXD1
RXD2: R299.2 ; port MII.RXD2
RXD3: R300.2 ; port MII.RXD3
RXDV: R294.2 ; port MII.RXDV
RXER: R295.2 ; port MII.RXER
TD_+: T1.1(TD+) U37.5(RXP)  [project net TD_+_17]
TD_-: T1.3(TD-) U37.4(RXM)  [project net TD_-_17]
TDCT: C505.1 T1.2(TDCT)  [project net TDCT_17]
TX_+: D42.4(D2+) D42.7(NC) J18.3 T1.16(TX+)  [project net TX_+_17]
TX_-: D42.5(D2-) D42.6(NC) J18.6 T1.14(TX-)  [project net TX_-_17]
TXC: U37.22(TXC/PME_EN) ; port MII.TXC
TXCT: R305.1 T1.15(TXCT)  [project net TXCT_17]
TXD0: U37.24(TXD0) ; port MII.TXD0
TXD1: U37.25(TXD1) ; port MII.TXD1
TXD2: U37.26(TXD2) ; port MII.TXD2
TXD3: U37.27(TXD3) ; port MII.TXD3
TXEN: U37.23(TXEN) ; port MII.TXEN
TXER: U37.31(TXER) ; port MII.TXER
NetC507_1: C507.1 R302.2 R303.2
NetC508_1: C508.1 R304.2 R305.2
NetC509_1: C509.1 TP113.1(A) U37.8(XO) X2.2
NetC510_1: C510.1 TP112.1(A) U37.9(XI) X2.1
NetJ18_11: J18.11(LED2_K) R293.1
NetR293_2: R293.2 R296.1
NetR294_1: R294.1 U37.18(RXDV/CONGIG2)
NetR295_1: R295.1 U37.20(RXER/ISO)
NetR297_1: R297.1 U37.16(RXD0/DUPLEX)
NetR298_1: R298.1 U37.15(RXD1/PHYAD2)
NetR299_1: R299.1 U37.14(RXD2/PHYAD1)
NetR300_1: R300.1 U37.13(RXD3/PHYAD0)
NetR301_1: R301.1 U37.19(RXC/B-CAST_OFF)
NetR306_1: R306.1 U37.10(REXT)
NetR306_2: R306.2 R307.1

Not connected (* = marked no-connect by the designer): J18 9(LED1_K)* 10(LED1_A)*; T1 4(NC)* 5(NC)* 12(NC)* 13(NC)*

### Layout directives
differential pair: RD_+, RD_-, RX_+, RX_-, TD_+, TD_-, TX_+, TX_-
net class ETHERNET: RD_+, RD_-, RX_+, RX_-, TD_+, TD_-, TX_+, TX_-
net class MII; net class S50: COL_CONFIG0, CRS_CONFIG1, INTRP, MDC, MDIO, RST_ETH_PHY, RXC, RXD0, RXD1, RXD2, RXD3, RXDV, RXER, TXC, TXD0, TXD1, TXD2, TXD3, TXEN, TXER

### Notes on the sheet
- R = (Vs-Vf) / mA
  R = (3.3V - 2.1 V ) / 0.002
  R = 600ohm
- Intern supply needing decoupling
- 6K49 required on REXT
- Magnetic Interface Circuit
  p.72
- Crystal setup
  p.71
- TODO
  POE
  (LTC4263IDE-1#PBF)?
- Reset Diagram
  datasheet p.69
- FREQs seeked
  50, 150 300 MHZ
  47nF + 1nF
- Sheet Name
- Project Title
- Global Project
- Revision
- Size
- Date
- Group
- Sheet
- of
- Filename
- Designers

### Library data of the parts
C504 C507 C508 = CAP_CER: as C501 on sheet USB; Operating Temperature: -55C - 125C; Temperature Coefficient: X7R; ComponentLink1Description: Digikey; ComponentLink1URL: https://www.digikey.com/en/products/detail/kemet/C1812C102KHRACAUTO/8109956; Part#: C1812C102KHRACAUTO; ComponentLink2Description: Datasheet; ComponentLink2URL: https://connect.kemet.com:7667/gateway/IntelliData-ComponentDocumentation/1.0/download/datasheet/C1812C102KHRACAUTO; Tolerance: 10%; Ratings: AEC-Q200; ComponentLink3Description: KEMET; ComponentLink3URL: https://www.kemet.com/en/us/capacitors/ceramic/product/C1812C102KHRACAUTO.html; ComponentLink4Description: Octopart; ComponentLink4URL: https://octopart.com/c1812c102khracauto-kemet-67309371?r=sp; Features: Low ESL, High Voltage; Supplier 1: Mouser; Supplier Part Number 1: 80-C1812C102KHRAUTO
C505 C506 C512 C516 C519 C520 C524 = CAP_CER: as C490 on sheet USB; Operating Temperature: -55C - 125C; Temperature Coefficient: X7R; ComponentLink1Description: Digikey; ComponentLink1URL: [Digikey Link]; Part#: GCM155R71H104KE02J; ComponentLink2Description: Datasheet; ComponentLink2URL: [Datasheet Link]; Tolerance: 10%; Ratings: AEC-Q200
C509 C510 = CAP_CER: 0402 22pF X7R Ceramic Capacitor / C0402C220K4RACAUTO; Operating Temperature: *; Temperature Coefficient: X7R; Mfr: *; ComponentLink1Description: Digikey; ComponentLink1URL: [Digikey Link]; Digikey Part No: *; ComponentLink2Description: Datasheet; ComponentLink2URL: [Datasheet Link]
C511 = CAP_CER: as C487 on sheet USB; Operating Temperature: -55C - 85C; Temperature Coefficient: X5R; ComponentLink1Description: Digikey; ComponentLink1URL: [Digikey Link]; ComponentLink2Description: Datasheet; ComponentLink2URL: [Datasheet Link]; Tolerance: 10%; Ratings: AEC-Q200; Part#: GRT31CR61H106KE01L
C513 C517 C521 C525 = CAP_CER: GCM155R71H473KE02J / 0402 47nF 10% X7R Ceramic Capacitor; Mfr: Murata; Operating Temperature: -55C - 125C; Temperature Coefficient: X7R; ComponentLink1Description: Digikey; ComponentLink1URL: [Digikey Link]; Part#: GCM155R71H473KE02J; ComponentLink2Description: Datasheet; ComponentLink2URL: [Datasheet Link]; Tolerance: 10%; Ratings: AEC-Q200
C514 C518 C522 C526 = CAP_CER: GCM155R72A102KA37D / 0402 1nF 10% X7R Ceramic Capacitor; Mfr: Murata; Operating Temperature: -55C - 125C; Temperature Coefficient: X7R; ComponentLink1Description: Digikey; ComponentLink1URL: [Digikey Link]; Part#: GCM155R72A102KA37D; ComponentLink2Description: Datasheet; ComponentLink2URL: [Datasheet Link]; Tolerance: 10%; Ratings: AEC-Q200
C515 = CAP_CER: CGA9P3X7R1H226M250KB / 2220 22uF 20% X7R Ceramic Capacitor; Mfr: TDK; Operating Temperature: -55C - 125C; Temperature Coefficient: X7R; ComponentLink1Description: Digikey; ComponentLink1URL: https://www.digikey.ca/en/products/detail/tdk-corporation/CGA9P3X7R1H226M250KB/10240627; ComponentLink2Description: Datasheet; ComponentLink2URL: https://product.tdk.com/system/files/dam/doc/product/capacitor/ceramic/mlcc/charasheet/cga9p3x7r1h226m250kb.pdf; Tolerance: 20%; Ratings: AEC-Q200; Part#: CGA9P3X7R1H226M250KB; Supplier 1: Arrow Electronics; Supplier Part Number 1: CGA9P3X7R1H226M250KB; ComponentLink3Description: TDK; ComponentLink3URL: https://product.tdk.com/en/search/capacitor/ceramic/mlcc/info?part_no=CGA9P3X7R1H226M250KB; ComponentLink4Description: Octopart; ComponentLink4URL: https://octopart.com/cga9p3x7r1h226m250kb-tdk-102764996?r=sp
C523 = CAP_CER: GRT31CR71H225KE13L / 1206 2.2uF 10% X7R Ceramic Capacitor; Mfr: Murata; Operating Temperature: -55C - 125C; Temperature Coefficient: X7R; ComponentLink1Description: Digikey; ComponentLink1URL: https://www.digikey.ca/en/products/detail/murata-electronics/GRT31CR71H225KE13L/10700891; Part#: GRT31CR71H225KE13L; ComponentLink2Description: Datasheet; ComponentLink2URL: https://search.murata.co.jp/Ceramy/image/img/A01X/G101/ENG/GRT31CR71H225KE13-01A.pdf; ComponentLink3Description: Octopart; ComponentLink3URL: https://octopart.com/grt31cr71h225ke13l-murata-76584457?r=sp; ComponentLink4Description: Murata; ComponentLink4URL: https://www.murata.com/en-us/products/productdetail?partno=GRT31CR71H225KE13%23; Tolerance: 10%; Ratings: AEC-Q200
D42 = TVS_DATA_TPD4E05U06: TVS - TVS DIODE 5.5VWM 14VC - 10SON; Manufacturer #1: Texas Instruments; Part Number #1: TPD4E05U06DQAR; Current Rating: 2.5A (8/20µs); Power Max: 40 W (peak); Value: 4 unidirectionnal channels; Voltage rating: 6V (Breakdown); Polarized: YES; Magnetic Material: UNKNOWN; GRAMS Lib Spec: 2.8; Manufacturer #2: *; Part Number #2: *; HelpURL: http://www.ti.com/lit/ds/symlink/tpd4e05u06.pdf; Supplier 1: Digi-Key; Supplier Part Number 1: 296-35765-1-ND; Note: *; Assembly Type: SMD; Temperature: -40°C ~ 125°C; Package: 10-USON; CreatedBy/Date: Olivier Bernard / 12/3/2018; Tolerance: *; VerifiedBy: Caroline Paulin / 4 juillet 2018; Cryo: UNKNOWN
D43 D46 = DIODE_SHOTTKEY: VS-15MQ040HM3/5AT; Diode Type: Schottky; Current: 1.5A; Reverse Voltage: 40V; Forward Voltage: 430mV @ 1.5A; Qualification: AEC-Q101; Package / Case: SMA; ComponentLink1Description: Digikey; ComponentLink1URL: https://www.digikey.ca/en/products/detail/diodes-incorporated/B340B-13-F/768869; ComponentLink2Description: Octopart; ComponentLink2URL: https://octopart.com/b340b-13-f-diodes+inc.-325817?r=sp
D44 D45 = TVS_DATA_TPD1E1B04DPYR: TVS - TVS DIODE 3.6V 8.5V - 0402; Manufacturer #1: Texas Instruments; Current Rating: 6.3Apeak; Power Max: 50Wpeak; GRAMS Lib Spec: 2.8; Magnetic Material: Unknown; Polarized: No; Value: *; Tolerance: *; Voltage Rating: 3.6V; HelpURL: http://www.ti.com/lit/ds/symlink/tpd1e1b04.pdf; CreatedBy/Date: Keven Deslandes - 2018/10/19; VerifiedBy: Caroline Paulin - 28 janv 2019; Temperature: -40°C ~ 125°C (TA); Package: 0402; Manufacturer #2: *; Note: *; Assembly Type: SMD; Part Number #2: *; Part Number #1: TPD1E1B04DPYR; Supplier 1: Digi-Key; Supplier Part Number 1: 296-47364-1-ND; Cryo: UNKNOWN
FB6 FB7 = FERRITE_BEAD: as FB5 on sheet USB; Operating Temperature: -55C - 125C; Rating: AEC-Q200; ComponentLink1Description: Digikey; ComponentLink1URL: https://www.digikey.ca/en/products/detail/w%C3%BCrth-elektronik/782853152/5168812; ComponentLink3Description: Octopart; ComponentLink3URL: https://octopart.com/782853152-wurth+elektronik-56466774?r=sp; ComponentLink5Description: Datasheet; ComponentLink5URL: https://www.we-online.com/en/components/products/datasheet/782853152.pdf
J18 = CONN_ETHERNET_RJHSE-5385: CONN - MOD JACK RJ45 R/A ETHERNET - TH; Mfg: Amphenol; Voltage: *; Current: *; Power: *; Mfg Part Number: RJHSE-5385; HelpURL: https://www.amphenolcanada.com/ProductSearch/drawings/AC/RJHSE538X.pdf; CreatedBy: Jonathan Bouchard; Temperature: -55°C ~ 85°C; Value: *; Precision: *; Package: TH-12; Supplier 1: Digikey; Supplier Part Number 1: RJHSE-5385-ND
R291-R295 R297-R308 = RESISTOR: Automotive: AEC-Q200; Operating Temperature: *; # Digikey: *; ComponentLink1Description: Digikey; ComponentLink1URL: *; # Manufacturer: *
R296 = RESISTOR: 1M 0603 1% 1/16W Resistor; Automotive: AEC-Q200; Operating Temperature: *; # Digikey: *; ComponentLink1Description: Digikey; ComponentLink1URL: *; # Manufacturer: *
T1 = TRANSFO_H1102NLT: TRANSFO - ETHERNET 10/100B-TX - SMD-16; Mfg: Pulse Eng.; Value: 1:1 (350uH); Voltage: *; Current: *; Power: *; Mfg Part Number: H1102NLT; HelpURL: http://media.digikey.com/pdf/Data%20Sheets/Pulse%20PDFs/10_100BASE-T%20Single%20Port%20SMD%20Magnetics_Rev2008.pdf; CreatedBy: Jonathan Bouchard; Temperature: -40°C to 85°C; Precision: *; Package: SMD-16; Supplier 1: Digikey; Supplier Part Number 1: 553-1532-1-ND
TP111 = TESTPOINT: Test Point; ClassName: Testpoint
TP112 TP113 = TESTPOINT_PAD_TINY: Test Point
TP114-TP118 = TESTPOINT_PAD: Test Point
U37 = COM_ETH_PHY_KSZ8091MNXCA: COM - ETHERNET PHY 10/100 - QFN-32; Voltage: 1.8V, 2.5V, 3.3V; Mfg: Micrel; Current: *; Power: *; Mfg Part Number: KSZ8091MNXCA; HelpURL: http://ww1.microchip.com/downloads/en/DeviceDoc/00002275A.pdf; CreatedBy: Jonathan Bouchard; Temperature: 0°C ~ 70°C; Value: *; Precision: *; Package: QFN-32; Supplier 1: Digikey; Supplier Part Number 1: 576-4356-ND
X2 = OSCILLATOR: 25 MHz ±30ppm Crystal 16pF 40 Ohms HC-49/US; Frequency Stability: 50ppm; Frequency Tolerance: 30ppm; Load Capacitance: 16pF; Operating Temperature: -10C - 60C; Rating: *; Type: *; ComponentLink1Description: Digikey; ComponentLink1URL: https://www.digikey.ca/en/products/detail/iqd-frequency-products/LFXTAL010595/8633762; ComponentLink2Description: Datasheet; ComponentLink2URL: https://www.iqdfrequencyproducts.com/products/datasheets/LFXTAL010595.pdf; ComponentLink3Description: Octopart; ComponentLink3URL: https://octopart.com/lfxtal010595-iqd+frequency+products-8426629; Supplier 1: Newark; Supplier Part Number 1: 94X0915

## Nets that join several sheets
+1V2D: POWER_FPGA (9 pins), POWER_SENSING (Q7.1 R333.1 U40.17), FPGA_MISC (31 pins)
+1V8D: POWER_FPGA (8 pins), POWER_SENSING (Q6.1 R328.1 U40.21), PROM (10 pins), ADC (16 pins), DAC (18 pins), FPGA_MISC (5 pins), FPGA_IO (10 pins)
+2V5D: POWER_DDR3 (16 pins), POWER_SENSING (R329.1 R330.1)
+3V3A: POWER_ANALOG (8 pins), ADC (12 pins), DAC (19 pins)
+3V3D: POWER_FPGA (13 pins), POWER_DDR3 (R222.1), POWER_MOTORS (C479.1 U32.1 U32.7), POWER_SENSING (11 pins), PROM (17 pins), FPGA_MISC (59 pins), FPGA_IO (42 pins), MOTOR_CONTROL (5 pins), USER_IO (36 pins), CLOCK (32 pins), USB (C487.1 C488.1 FB5.1), ETHERNET (6 pins)
+5V: POWER_INPUT (5 pins), MOTOR_CONTROL (C363.1 C367.1 U18.3 U18.4)
+5V0A: POWER_ANALOG (8 pins), ADC (18 pins), DAC (5 pins)
+5V_MOT: POWER_MOTORS (12 pins), MOTOR_CONTROL (18 pins)
+6V: POWER_ANALOG (15 pins), POWER_SENSING (R319.1 R320.1)
+12V: POWER_INPUT (10 pins), POWER_FPGA (C465.1 C466.1 R244.1 U29.1), POWER_DDR3 (C434.1 C435.1 U26.1), POWER_ANALOG (8 pins), POWER_SENSING (R315.1 R316.1 R326.1 R331.1), FPGA_MISC (C105.1 J2.2)
+24V_IN: POWER_INPUT (9 pins), POWER_MOTORS (R272.1 U36.1)
+24V_MOT: POWER_MOTORS (13 pins), MOTOR_CONTROL (8 pins)
+VDDR: DDR3 (83 pins), POWER_DDR3 (12 pins), POWER_SENSING (R321.1), FPGA_MISC (C143.1 C144.1 C145.1 C146.1), FPGA_IO (6 pins)
+VREF_DDR: POWER_DDR3 (C430.1 C431.1 TP87.1 U27.6), FPGA_IO (C149.1 U4.C3 U4.L8)
+VTT: DDR3 (59 pins), POWER_DDR3 (8 pins), POWER_SENSING (R322.1)
-5V0A: POWER_ANALOG (9 pins), ADC (18 pins), DAC (5 pins)
-6V: POWER_ANALOG (12 pins), POWER_SENSING (R318.2)
GND: MECHANICAL (19 pins), DDR3 (116 pins), POWER_INPUT (14 pins), POWER_FPGA (34 pins), POWER_DDR3 (51 pins), POWER_ANALOG (87 pins), POWER_MOTORS (C479.2 U32.2 U32.8), POWER_SENSING (39 pins), PROM (28 pins), ADC (80 pins), DAC (70 pins), FPGA_MISC (132 pins), FPGA_IO (5 pins), MOTOR_CONTROL (10 pins), USER_IO (47 pins), CLOCK (56 pins), USB (23 pins), ETHERNET (35 pins)
GND_IN: POWER_INPUT (9 pins), POWER_MOTORS (C486.1 R276.2 SW4.2 U36.3)
GND_MOT: POWER_MOTORS (23 pins), MOTOR_CONTROL (46 pins)
+1V2D_SHUNT_+: POWER_FPGA (NT51.2), POWER_SENSING (U41.12)
+1V2D_SHUNT_-: POWER_FPGA (NT50.2), POWER_SENSING (U41.13)
+1V8D_SHUNT_+: POWER_FPGA (NT49.2), POWER_SENSING (U41.10)
+1V8D_SHUNT_-: POWER_FPGA (NT48.2), POWER_SENSING (U41.9)
+2V5D_SHUNT_+: POWER_DDR3 (NT45.2), POWER_SENSING (U41.3)
+2V5D_SHUNT_-: POWER_DDR3 (NT44.2), POWER_SENSING (U41.2)
+3V3A_EN: POWER_ANALOG (R190.2), FPGA_IO (U4.A20)
+3V3D_SHUNT_+: POWER_FPGA (NT47.2), POWER_SENSING (U41.5)
+3V3D_SHUNT_-: POWER_FPGA (NT46.2), POWER_SENSING (U41.6)
+5V0A_EN: POWER_ANALOG (R189.2), FPGA_IO (U4.A21)
+6V_EN: POWER_ANALOG (R187.2 R197.1), FPGA_IO (U4.C21)
+6V_SHUNT_+: POWER_ANALOG (NT41.2), POWER_SENSING (U39.5)
+6V_SHUNT_-: POWER_ANALOG (NT40.2), POWER_SENSING (U39.6)
+12V_SHUNT_+: POWER_INPUT (NT39.2), POWER_SENSING (U39.3)
+12V_SHUNT_-: POWER_INPUT (NT38.2), POWER_SENSING (U39.2)
-5V0A_EN: POWER_ANALOG (R217.2 R219.1), FPGA_IO (U4.B22)
-6V_EN: POWER_ANALOG (R214.2 R215.1), FPGA_IO (U4.T20)
-6V_SHUNT_+: POWER_ANALOG (NT43.2), POWER_SENSING (U39.9)
-6V_SHUNT_-: POWER_ANALOG (NT42.2), POWER_SENSING (U39.10)
~{CAS}: DDR3 (NT8.2 U1.K3), FPGA_IO (U4.K6)
~{CE}: PROM (U6.B4), FPGA_IO (R63.2 U4.AF23)
~{CEO}: PROM (U6.D2), FPGA_IO (U4.AF18)
~{CF}: PROM (U6.D1), FPGA_IO (U4.AA17)
~{CS}: DAC (TP65.1 U11.33), FPGA_IO (U4.R3)
~{DDR_CS}: DDR3 (NT4.2 U1.L2), FPGA_IO (U4.K8)
~{DDR_RESET}: DDR3 (NT18.2 U1.T2), FPGA_IO (U4.B2)
~{ENABLE_ISO}: FPGA_IO (U4.V8), MOTOR_CONTROL (U13.3)
~{HOME_ISO}: FPGA_IO (U4.U9), MOTOR_CONTROL (ISO1.4)
~{IRQ}: DAC (U11.34), FPGA_IO (U4.N7)
~{PLL_SYNC}: FPGA_IO (U4.H17), CLOCK (TP15.1 U5.14)
~{RAS}: DDR3 (NT6.2 U1.J3), FPGA_IO (U4.K7)
~{RESET_ISO}: FPGA_IO (U4.V10), MOTOR_CONTROL (U13.2)
~{RST_DAC}: DAC (R132.2 TP64.1 U11.36), FPGA_IO (U4.P7)
~{SENSE_CS}: POWER_SENSING (R312.2 U40.31), FPGA_IO (U4.B6)
~{SLEEP_ISO}: FPGA_IO (U4.T10), MOTOR_CONTROL (U17.3)
~{WDT_EN}: FPGA_MISC (R57.2 U3.3), FPGA_IO (U4.A25)
~{WE}: DDR3 (NT10.2 U1.L3), FPGA_IO (U4.E4)
ADC_CTRL1: ADC (TP44.1 U9.35), FPGA_IO (U4.T6)
ADC_CTRL2: ADC (TP45.1 U9.36), FPGA_IO (U4.T8)
ADC_CTRL3: ADC (TP46.1 U9.37), FPGA_IO (U4.M10)
ADC_SCLK: ADC (TP40.1 U9.13), FPGA_IO (U4.N8)
AUXIN: FPGA_IO (U4.W19), MOTOR_CONTROL (U18.9)
BTN_1: FPGA_IO (U4.Y15), USER_IO (6 pins)
BTN_2: FPGA_IO (U4.Y14), USER_IO (6 pins)
BUSY: PROM (R79.1 U6.C1), FPGA_IO (U4.Y16)
CK_N: DDR3 (NT27.2 U1.K7), FPGA_IO (U4.G3)
CK_P: DDR3 (NT24.2 U1.J7), FPGA_IO (U4.G4)
CKE: DDR3 (NT2.2 U1.K9), FPGA_IO (U4.F5)
CLK: PROM (U6.B3), FPGA_IO (R62.2 R64.1 U4.AD22)
CLK_ADC_400MHZ_N: ADC (C236.1 R94.1), CLOCK (U5.17)
CLK_ADC_400MHZ_P: ADC (C235.1 R95.1), CLOCK (U5.16)
CLK_ADC_OUT_N: ADC (TP39.1 U9.56), FPGA_IO (U4.A13)
CLK_ADC_OUT_P: ADC (TP37.1 U9.57), FPGA_IO (U4.C13)
CLK_DAC_200MHZ_N: DAC (R128.1 U11.4), CLOCK (U5.20)
CLK_DAC_200MHZ_P: DAC (R129.1 U11.3), CLOCK (U5.19)
CLK_FPGA_100MHZ_N: FPGA_IO (U4.B14), CLOCK (TP22.1 U5.28)
CLK_FPGA_100MHZ_P: FPGA_IO (U4.A14), CLOCK (TP21.1 U5.27)
CLKOUT: PROM (U6.C2), FPGA_IO (U4.AD18)
COL_CONFIG0: FPGA_IO (U4.R24), ETHERNET (U37.28)
CRS_CONFIG1: FPGA_IO (U4.N20), ETHERNET (U37.29)
D0_N: DAC (R151.1 U11.28), FPGA_IO (U4.F11)
D0_P: DAC (R148.1 U11.27), FPGA_IO (U4.D11)
D1_N: DAC (R144.1 U11.26), FPGA_IO (U4.E9)
D1_P: DAC (R141.1 U11.25), FPGA_IO (U4.F9)
D2_N: DAC (R138.1 U11.24), FPGA_IO (U4.A11)
D2_P: DAC (R135.1 U11.23), FPGA_IO (U4.C11)
D3_N: DAC (R150.1 U11.22), FPGA_IO (U4.C10)
D3_P: DAC (R147.1 U11.21), FPGA_IO (U4.D10)
D4_N: DAC (R143.1 U11.16), FPGA_IO (U4.C8)
D4_P: DAC (R140.1 U11.15), FPGA_IO (U4.D8)
D5_N: DAC (R137.1 U11.14), FPGA_IO (U4.A8)
D5_P: DAC (R134.1 U11.13), FPGA_IO (U4.B8)
D6_N: DAC (R149.1 U11.12), FPGA_IO (U4.A9)
D6_P: DAC (R146.1 U11.11), FPGA_IO (U4.C9)
D7_N: DAC (R142.1 U11.10), FPGA_IO (U4.A10)
D7_P: DAC (R139.1 U11.9), FPGA_IO (U4.B10)
DA0_N: ADC (U9.40), FPGA_IO (U4.C14)
DA0_P: ADC (U9.41), FPGA_IO (U4.D14)
DA2_N: ADC (U9.42), FPGA_IO (U4.A15)
DA2_P: ADC (U9.43), FPGA_IO (U4.C15)
DA4_N: ADC (U9.44), FPGA_IO (U4.A16)
DA4_P: ADC (U9.45), FPGA_IO (U4.B16)
DA6_N: ADC (U9.46), FPGA_IO (U4.G14)
DA6_P: ADC (U9.47), FPGA_IO (U4.J14)
DA8_N: ADC (U9.50), FPGA_IO (U4.H15)
DA8_P: ADC (U9.51), FPGA_IO (U4.J15)
DA10_N: ADC (U9.52), FPGA_IO (U4.C16)
DA10_P: ADC (U9.53), FPGA_IO (U4.D16)
DA12_N: ADC (U9.54), FPGA_IO (U4.F15)
DA12_P: ADC (U9.55), FPGA_IO (U4.G16)
DAC_SCLK: DAC (TP62.1 U11.32), FPGA_IO (U4.P6)
DB0_N: ADC (U9.60), FPGA_IO (U4.E16)
DB0_P: ADC (U9.61), FPGA_IO (U4.F16)
DB2_N: ADC (U9.62), FPGA_IO (U4.A17)
DB2_P: ADC (U9.63), FPGA_IO (U4.C17)
DB4_N: ADC (U9.2), FPGA_IO (U4.D19)
DB4_P: ADC (U9.3), FPGA_IO (U4.E19)
DB6_N: ADC (U9.4), FPGA_IO (U4.D20)
DB6_P: ADC (U9.5), FPGA_IO (U4.E20)
DB8_N: ADC (U9.6), FPGA_IO (U4.C20)
DB8_P: ADC (U9.7), FPGA_IO (U4.D21)
DB10_N: ADC (U9.8), FPGA_IO (U4.C18)
DB10_P: ADC (U9.9), FPGA_IO (U4.D18)
DB12_N: ADC (U9.10), FPGA_IO (U4.E17)
DB12_P: ADC (U9.11), FPGA_IO (U4.F17)
DCI_N: DAC (R136.1 U11.18), FPGA_IO (U4.D7)
DCI_P: DAC (R133.1 U11.17), FPGA_IO (U4.E8)
DDR_PWR_EN: POWER_DDR3 (R231.2), FPGA_IO (U4.AE26)
DDR_SW_EN: POWER_DDR3 (R223.2 R227.1), FPGA_IO (U4.AA25)
DDR_VTT_EN: POWER_DDR3 (R225.1), FPGA_IO (U4.AE25)
DEBUG_LED_1: FPGA_IO (U4.AF9), USER_IO (R172.1)
DEBUG_LED_2: FPGA_IO (U4.AD11), USER_IO (R173.1)
DEBUG_LED_3: FPGA_IO (U4.AE11), USER_IO (R183.1)
DEBUG_LED_4: FPGA_IO (U4.AF11), USER_IO (R184.1)
DIR_ISO: FPGA_IO (U4.U7), MOTOR_CONTROL (U16.2)
EN_EXT_SEL: PROM (R82.2 U6.H4), FPGA_IO (U4.AD19)
FAN_PWM: FPGA_MISC (D1.2 R54.1), FPGA_IO (U4.P18)
FAN_TACH: FPGA_MISC (D2.2 R55.1 R56.2), FPGA_IO (U4.R20)
FRAME_N: DAC (R131.1 U11.20), FPGA_IO (U4.C6)
FRAME_P: DAC (R130.1 U11.19), FPGA_IO (U4.D6)
IN0: FPGA_IO (U4.AF12), USER_IO (U19.3)
IN1: FPGA_IO (U4.AD12), USER_IO (U19.6)
IN2: FPGA_IO (U4.AD13), USER_IO (U19.8)
IN3: FPGA_IO (U4.AC13), USER_IO (U19.11)
INTRP: FPGA_IO (U4.M21), ETHERNET (R292.2 U37.21)
IO_IN_EN: FPGA_IO (U4.AA12), USER_IO (U19.1 U19.4 U19.10 U19.13)
IO_OUT_EN: FPGA_IO (U4.AC12), USER_IO (U20.1 U20.4 U20.10 U20.13)
LDM: DDR3 (NT16.2 U1.E7), FPGA_IO (U4.J3)
LDQS_N: DDR3 (U1.F3), FPGA_IO (U4.F1)
LDQS_P: DDR3 (U1.G3), FPGA_IO (U4.F3)
MDC: FPGA_IO (U4.R23), ETHERNET (U37.12)
MDIO: FPGA_IO (U4.AB24), ETHERNET (R291.2 U37.11)
MISO: ADC (TP43.1 U9.64), FPGA_IO (U4.R9)
MOSI: ADC (TP42.1 U9.14), FPGA_IO (U4.P8)
NetU4_T18: POWER_MOTORS (U32.4), FPGA_IO (U4.T18)
NetU4_T19: POWER_MOTORS (U32.5), FPGA_IO (U4.T19)
NetU4_U21: POWER_MOTORS (U32.6), FPGA_IO (U4.U21)
NetU4_U23: POWER_MOTORS (U32.3), FPGA_IO (U4.U23)
ODT: DDR3 (NT12.2 U1.K1), FPGA_IO (U4.H7)
OE/RESET: PROM (U6.A3), FPGA_IO (R65.2 U4.AE4)
OUT0: FPGA_IO (U4.AB13), USER_IO (U20.2)
OUT1: FPGA_IO (U4.AA13), USER_IO (U20.5)
OUT2: FPGA_IO (U4.Y13), USER_IO (U20.9)
OUT3: FPGA_IO (U4.W13), USER_IO (U20.12)
PLL_LOCK: FPGA_IO (U4.B20), CLOCK (TP20.1 U5.37)
PLL_SPI_CLK: FPGA_IO (U4.A18), CLOCK (TP17.1 U5.24)
PLL_SPI_LE: FPGA_IO (U4.B18), CLOCK (TP16.1 U5.25)
PLL_SPI_MISO: FPGA_IO (U4.A19), CLOCK (TP19.1 U5.22)
PLL_SPI_MOSI: FPGA_IO (U4.C19), CLOCK (TP18.1 U5.23)
PROGRAM_B: FPGA_IO (R66.2 R67.1 R68.1 U4.AF3), USB (R277.2 R285.1)
PROM_D0: PROM (U6.H6), FPGA_IO (U4.AD20)
PROM_D1: PROM (U6.H5), FPGA_IO (U4.AE17)
PROM_D2: PROM (U6.E5), FPGA_IO (U4.AF17)
PROM_D3: PROM (U6.D5), FPGA_IO (U4.AD10)
PROM_D4: PROM (U6.C5), FPGA_IO (U4.AF10)
PROM_D5: PROM (U6.B5), FPGA_IO (U4.AE7)
PROM_D6: PROM (U6.A5), FPGA_IO (U4.AF7)
PROM_D7: PROM (U6.A6), FPGA_IO (U4.AE9)
REF_CLK_N: DAC (TP67.1 U11.7), FPGA_IO (U4.R1)
REF_CLK_P: DAC (TP66.1 U11.6), FPGA_IO (U4.R2)
RESET: ADC (TP38.1 U9.12), FPGA_IO (U4.P10)
REV_SEL0: PROM (R80.1 U6.G3), FPGA_IO (U4.W17)
REV_SEL1: PROM (R81.1 U6.G4), FPGA_IO (U4.V16)
RFUSE: FPGA_MISC (J1.2 TP4.1), FPGA_IO (U4.AA20)
RST_ETH_PHY: FPGA_IO (U4.N19), ETHERNET (D46.2)
RTC_MFP: FPGA_MISC (R45.2 TP5.1 U2.7), FPGA_IO (U4.L24)
RTC_SCL: FPGA_MISC (R47.2 TP7.1 U2.6), FPGA_IO (U4.K19)
RTC_SDA: FPGA_MISC (R46.2 TP6.1 U2.5), FPGA_IO (U4.L19)
RXC: FPGA_IO (U4.W25), ETHERNET (R301.2)
RXD: FPGA_IO (U4.W18), MOTOR_CONTROL (U18.5)
RXD0: FPGA_IO (U4.V23), ETHERNET (R297.2)
RXD1: FPGA_IO (U4.W24), ETHERNET (R298.2)
RXD2: FPGA_IO (U4.U25), ETHERNET (R299.2)
RXD3: FPGA_IO (U4.U26), ETHERNET (R300.2)
RXDV: FPGA_IO (U4.P21), ETHERNET (R294.2)
RXER: FPGA_IO (U4.P22), ETHERNET (R295.2)
SD_CLK: FPGA_IO (U4.R19), USER_IO (J15.5 R181.2)
SD_CMD: FPGA_IO (U4.R17), USER_IO (J15.3 R180.2)
SD_D0: FPGA_IO (U4.U24), USER_IO (J15.7 R176.2)
SD_D1: FPGA_IO (U4.R22), USER_IO (J15.8 R177.2)
SD_D2: FPGA_IO (U4.R21), USER_IO (J15.1 R178.2)
SD_D3: FPGA_IO (U4.P17), USER_IO (J15.2 R179.2)
SD_DET: FPGA_IO (U4.R18), USER_IO (J15.DL J15.DS R175.2)
SDIO: DAC (TP63.1 U11.31), FPGA_IO (U4.R4)
SEN: ADC (TP41.1 U9.15), FPGA_IO (U4.R7)
SENSE_MISO: POWER_SENSING (U40.34), FPGA_IO (U4.A7)
SENSE_MOSI: POWER_SENSING (U40.33), FPGA_IO (U4.A6)
SENSE_SCLK: POWER_SENSING (U40.32), FPGA_IO (U4.A5)
SILENT: FPGA_IO (U4.AB21), MOTOR_CONTROL (U18.6)
SR_ISO: FPGA_IO (U4.U5), MOTOR_CONTROL (U16.3)
STBY: FPGA_IO (U4.AB22), MOTOR_CONTROL (U18.8)
STEP_ISO: FPGA_IO (U4.W10), MOTOR_CONTROL (U17.2)
SUSPEND: FPGA_MISC (R52.2 TP8.1), FPGA_IO (U4.AD23)
TXC: FPGA_IO (U4.W26), ETHERNET (U37.22)
TXD: FPGA_IO (U4.AF25), MOTOR_CONTROL (U18.7)
TXD0: FPGA_IO (U4.T24), ETHERNET (U37.24)
TXD1: FPGA_IO (U4.T26), ETHERNET (U37.25)
TXD2: FPGA_IO (U4.Y24), ETHERNET (U37.26)
TXD3: FPGA_IO (U4.Y26), ETHERNET (U37.27)
TXEN: FPGA_IO (U4.V24), ETHERNET (U37.23)
TXENABLE: DAC (U11.30), FPGA_IO (U4.N6)
TXER: FPGA_IO (U4.V26), ETHERNET (U37.31)
UDM: DDR3 (NT14.2 U1.D3), FPGA_IO (U4.J4)
UDQS_N: DDR3 (U1.C7), FPGA_IO (U4.L1)
UDQS_P: DDR3 (U1.B7), FPGA_IO (U4.L2)
USB_CTS: FPGA_IO (U4.G20), USB (M1.3)
USB_RTS: FPGA_IO (U4.G21), USB (M1.4)
USB_RX: FPGA_IO (U4.A23), USB (M1.5)
USB_TX: FPGA_IO (U4.B23), USB (M1.6)
USM0_ISO: FPGA_IO (U4.U8), MOTOR_CONTROL (U15.2)
USM1_ISO: FPGA_IO (U4.Y5), MOTOR_CONTROL (U15.3)
VBATT: FPGA_MISC (C101.1 R48.1 R51.1 TP9.1), FPGA_IO (U4.W21)
VFS: FPGA_MISC (C102.1 R49.1 TP10.1), FPGA_IO (U4.AB19)
VTT_PG: POWER_DDR3 (R222.2 U27.9), FPGA_IO (U4.AA26)
WDT_IN: FPGA_MISC (U3.4), FPGA_IO (U4.B24)
WDTO: FPGA_MISC (J4.2), FPGA_IO (R66.1 U4.C25)

## Assembly variants
PCB_S7: not fitted C134 C135 R4 R5 R6 R7 R8 R9 R10 R11 R12 R13 R14 R15 R16 R17 R18 R23 R28 R29 R31 R66 R68 R72 R111 R248 R?